# EAGLE design SmartVehicle_3 (EAGLE 7.7.0)

## Sheet 1 of 6
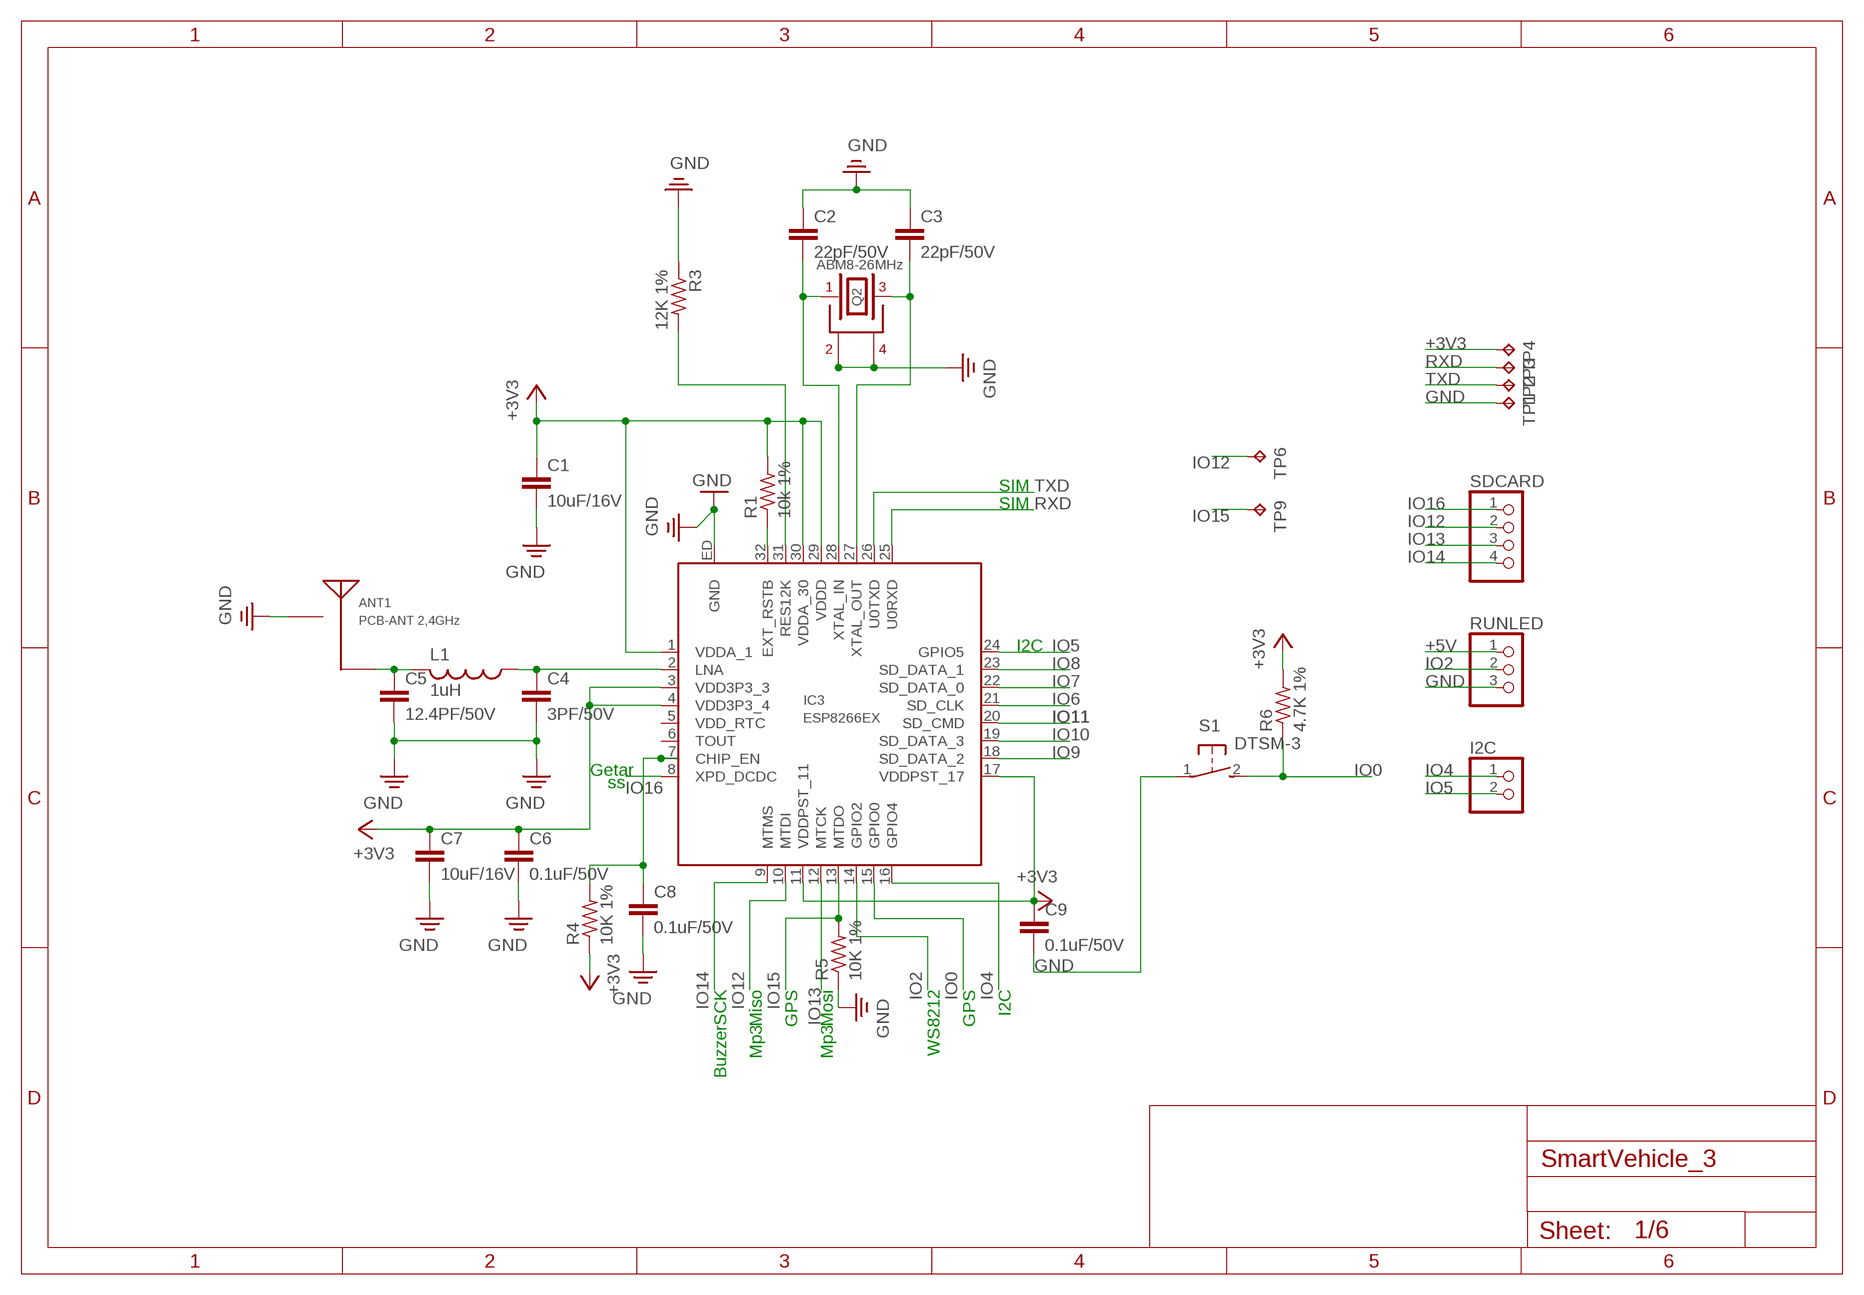
[diagram p0: schematic, sheet 1]

### Parts
ANT1  PCB-ANT 2,4GHz  2.4GHZ_PCB  [2.4GHZ_PCB]
C1  10uF/16V  C-EUC0603  [C0603]
C2  22pF/50V  C-EUC0603  [C0603]
C3  22pF/50V  C-EUC0603  [C0603]
C4  3PF/50V  C-EUC0603  [C0603]
C5  12.4PF/50V  C-EUC0603  [C0603]
C6  0.1uF/50V  C-EUC0603  [C0603]
C7  10uF/16V  C-EUC0603  [C0603]
C8  0.1uF/50V  C-EUC0603  [C0603]
C9  0.1uF/50V  C-EUC0603  [C0603]
I2C  PINHD-1X2  [1X02]
IC3  ESP8266EX  [ESP8266EX]
L1  1uH  L-USL2012C  [L2012C]
Q2  ABM8-26MHz  ABM8G  [ABM8G]
R1  10k 1%  R-US_R0603  [R0603]
R3  12K 1%  R-US_R0603  [R0603]
R4  10K 1%  R-US_R0603  [R0603]
R5  10K 1%  R-US_R0603  [R0603]
R6  4.7K 1%  R-US_R0603  [R0603]
RUNLED  PINHD-1X3  [1X03]
S1  DTSM-3  [DTSM-3]
SDCARD  PINHD-1X4  [1X04]
TP1  TPB1,27  [B1,27]
TP2  TPB1,27  [B1,27]
TP3  TPB1,27  [B1,27]
TP4  TPB1,27  [B1,27]
TP6  TPB1,27  [B1,27]
TP9  TPB1,27  [B1,27]

### Nets
+3V3: C1.1 C6.1 C7.1 C9.1 IC3.1(VDDA_1) IC3.3(VDD3P3_3) IC3.4(VDD3P3_4) IC3.11(VDDPST_11) IC3.17(VDDPST_17) IC3.29(VDDD) IC3.30(VDDA_30) R1.2 R4.1 R6.2 TP4.TP ; also sheet 3,4
+5V: RUNLED.1 ; also sheet 2,3,5,6
GND: ANT1.GND C1.2 C2.1 C3.1 C4.2 C5.2 C6.2 C7.2 C8.2 C9.2 IC3.ED(GND) Q2.2 Q2.4 R3.1 R5.1 RUNLED.3 S1.1 TP1.TP ; also sheet 2,3,4,5,6
IO0: IC3.15(GPIO0) R6.1 S1.2
IO2: IC3.14(GPIO2) RUNLED.2
IO4: I2C.1 IC3.16(GPIO4) ; also sheet 4
IO5: I2C.2 IC3.24(GPIO5) ; also sheet 4
IO6: IC3.21(SD_CLK)
IO7: IC3.22(SD_DATA_0)
IO8: IC3.23(SD_DATA_1)
IO9: IC3.18(SD_DATA_2)
IO10: IC3.19(SD_DATA_3)
IO11: IC3.20(SD_CMD)
IO12: IC3.10(MTDI) SDCARD.2 TP6.TP
IO13: IC3.12(MTCK) SDCARD.3 ; also sheet 3
IO14: IC3.9(MTMS) SDCARD.4
IO15: IC3.13(MTDO) R5.2 TP9.TP ; also sheet 3
IO16: IC3.8(XPD_DCDC) SDCARD.1
N$1: IC3.32(EXT_RSTB) R1.1
N$2: IC3.31(RES12K) R3.2
N$3: C2.2 IC3.28(XTAL_IN) Q2.1
N$4: C4.1 IC3.2(LNA) L1.1
N$5: C3.2 IC3.27(XTAL_OUT) Q2.3
N$6: ANT1.ANT C5.1 L1.2
N$10: C8.1 IC3.7(CHIP_EN) R4.2
RXD: IC3.25(U0RXD) TP3.TP ; also sheet 2
TXD: IC3.26(U0TXD) TP2.TP ; also sheet 2
Unconnected: IC3.5(VDD_RTC) IC3.6(TOUT)

### Notes on the sheet
- SIM
- SIM
- I2C
- Getar | ss
- SCK | Miso | GPS | Mosi | WS8212 | GPS | I2C
- Buzzer | Mp3 | Mp3

## Sheet 2 of 6
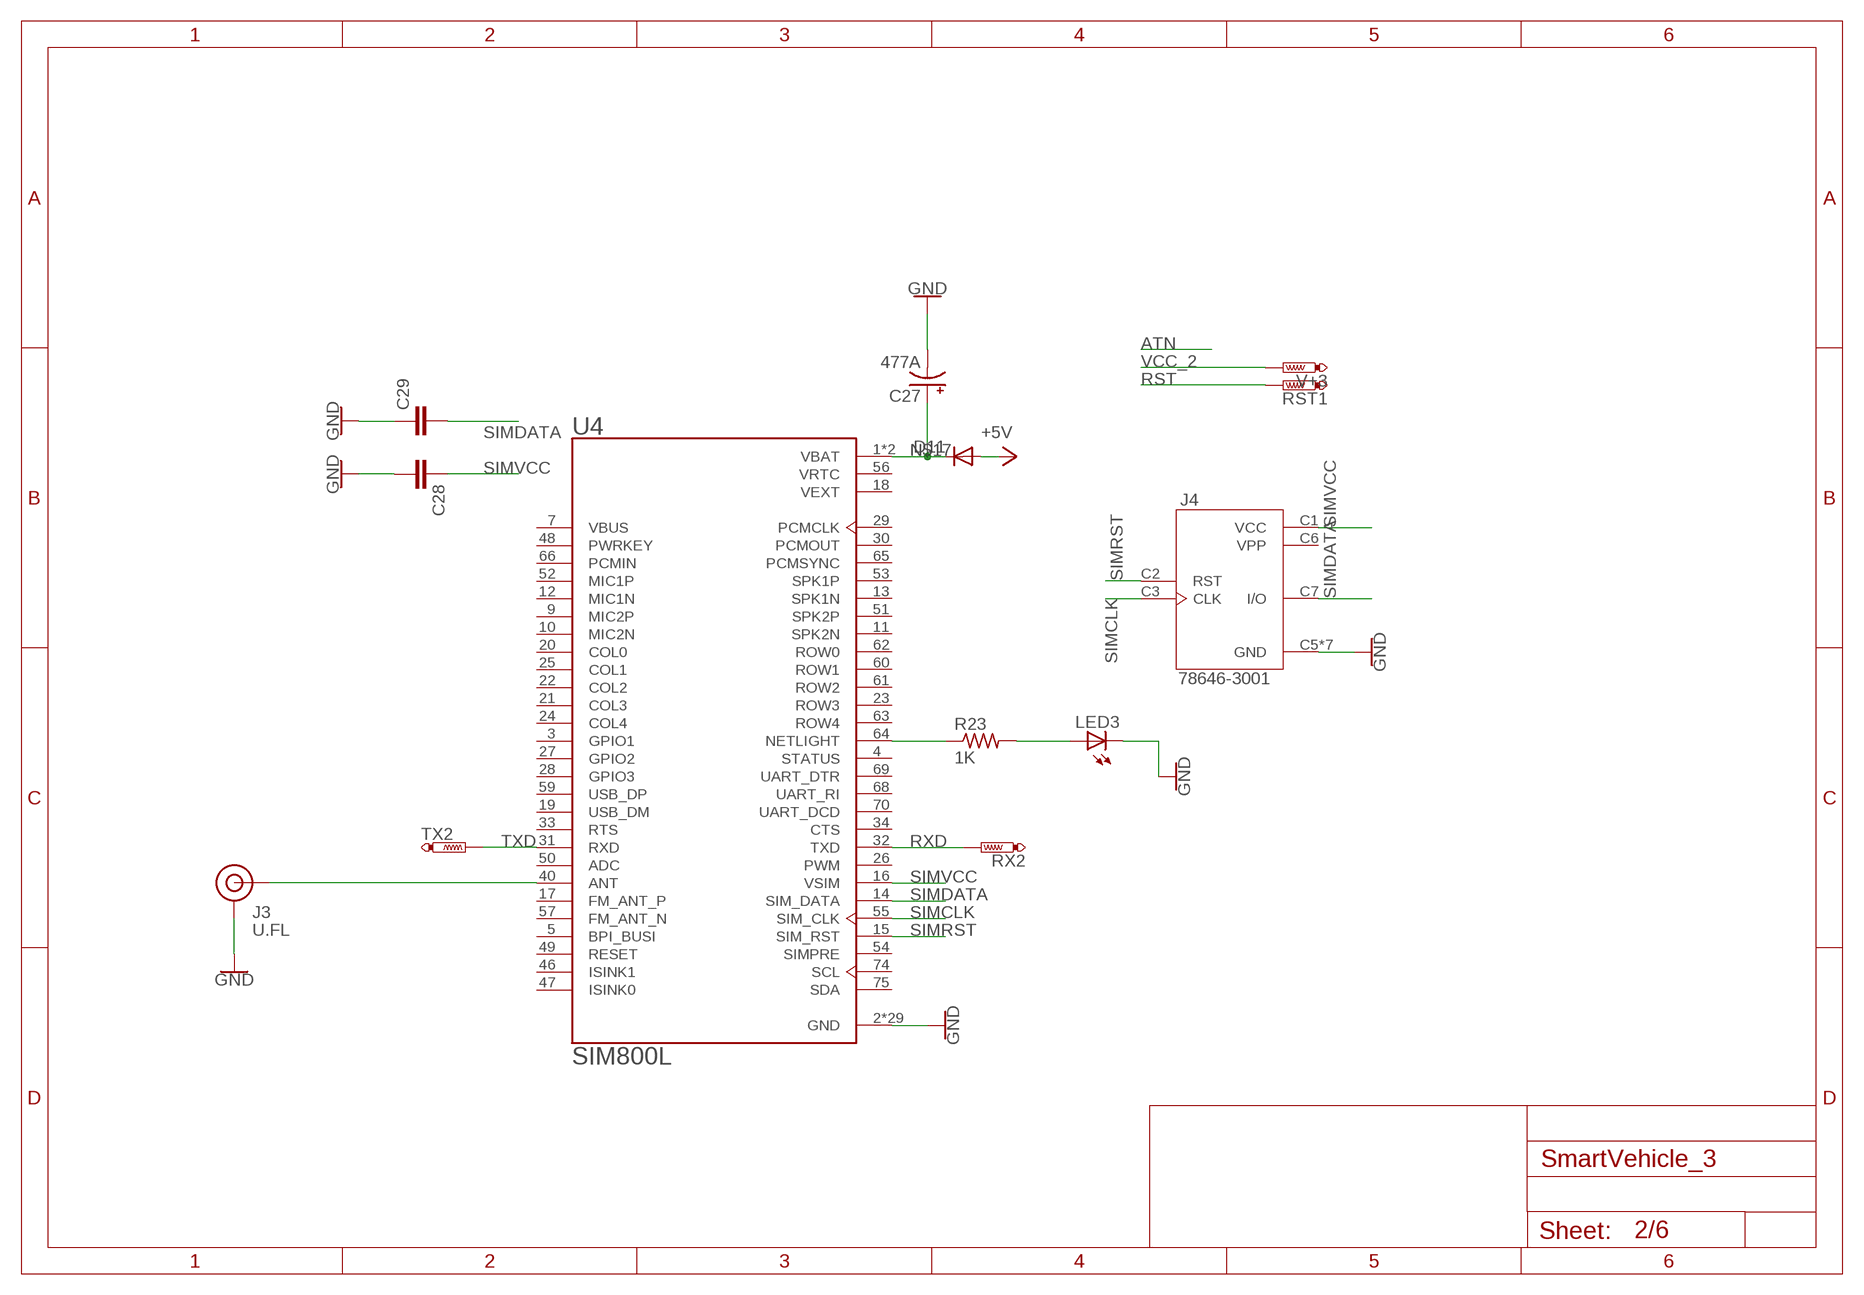
[diagram p1: schematic, sheet 2]

### Parts
C27  477A  CPOL-USCT7343  [CT7343]
C28  C-EUC0805  [C0805]
C29  C-EUC0805  [C0805]
D11  DIODE-DO214AC  [DO214AC]
J3  U.FL  U.FL2PIN  [U.FL]
J4  78646-3001  [MOLEX_78646-3001]
LED3  LEDCHIP-LED0805  [CHIP-LED0805]
R23  1K  R-US_R0603  [R0603]
RST1  PTR1TP08R  [TP08R]
RX2  PTR1TP08R  [TP08R]
TX2  PTR1TP08R  [TP08R]
U4  SIM800L  [MODULE_SIM800L]
V+3  PTR1TP08R  [TP08R]

### Nets
+5V: D11.A ; also sheet 1,3,5,6
GND: C27.- C28.2 C29.1 J3.1(GND) J3.2(GND) J4.C5(GND) J4.G1(GND) J4.G2(GND) J4.G3(GND) J4.G4(GND) J4.G5(GND) J4.G6(GND) LED3.C U4.2(GND) U4.6(GND) U4.8(GND) U4.35(GND) U4.37(GND) U4.38(GND) U4.39(GND) U4.41(GND) U4.43(GND) U4.44(GND) U4.45(GND) U4.58(GND) U4.67(GND) U4.71(GND) U4.72(GND) U4.73(GND) U4.76(GND) U4.77(GND) U4.78(GND) U4.79(GND) U4.80(GND) U4.81(GND) U4.82(GND) U4.83(GND) U4.84(GND) U4.85(GND) U4.86(GND) U4.87(GND) U4.88(GND) ; also sheet 1,3,4,5,6
N$12: R23.1 U4.64(NETLIGHT)
N$17: C27.+ D11.C U4.1(VBAT) U4.42(VBAT)
N$46: LED3.A R23.2
N$47: J3.FEED(SIGNAL) U4.40(ANT)
RST: RST1.TP
RXD: RX2.TP U4.32(TXD) ; also sheet 1
SIMCLK: J4.C3(CLK) U4.55(SIM_CLK)
SIMDATA: C29.2 J4.C7(I/O) U4.14(SIM_DATA)
SIMRST: J4.C2(RST) U4.15(SIM_RST)
SIMVCC: C28.1 J4.C1(VCC) U4.16(VSIM)
TXD: TX2.TP U4.31(RXD) ; also sheet 1
VCC_2: V+3.TP
Unconnected: U4.3(GPIO1) U4.4(STATUS) U4.5(BPI_BUSI) U4.7(VBUS) U4.9(MIC2P) U4.10(MIC2N) U4.11(SPK2N) U4.12(MIC1N) U4.13(SPK1N) U4.17(FM_ANT_P) U4.19(USB_DM) U4.20(COL0) U4.21(COL3) U4.22(COL2) U4.23(ROW3) U4.24(COL4) U4.25(COL1) U4.26(PWM) U4.27(GPIO2) U4.28(GPIO3) U4.29(PCMCLK) U4.30(PCMOUT) U4.33(RTS) U4.34(CTS) U4.46(ISINK1) U4.47(ISINK0) U4.48(PWRKEY) U4.49(RESET) U4.50(ADC) U4.51(SPK2P) U4.52(MIC1P) U4.53(SPK1P) U4.54(SIMPRE) U4.57(FM_ANT_N) U4.59(USB_DP) U4.60(ROW1) U4.61(ROW2) U4.62(ROW0) U4.63(ROW4) U4.65(PCMSYNC) U4.66(PCMIN) U4.68(UART_RI) U4.69(UART_DTR) U4.70(UART_DCD) U4.74(SCL) U4.75(SDA)

## Sheet 3 of 6
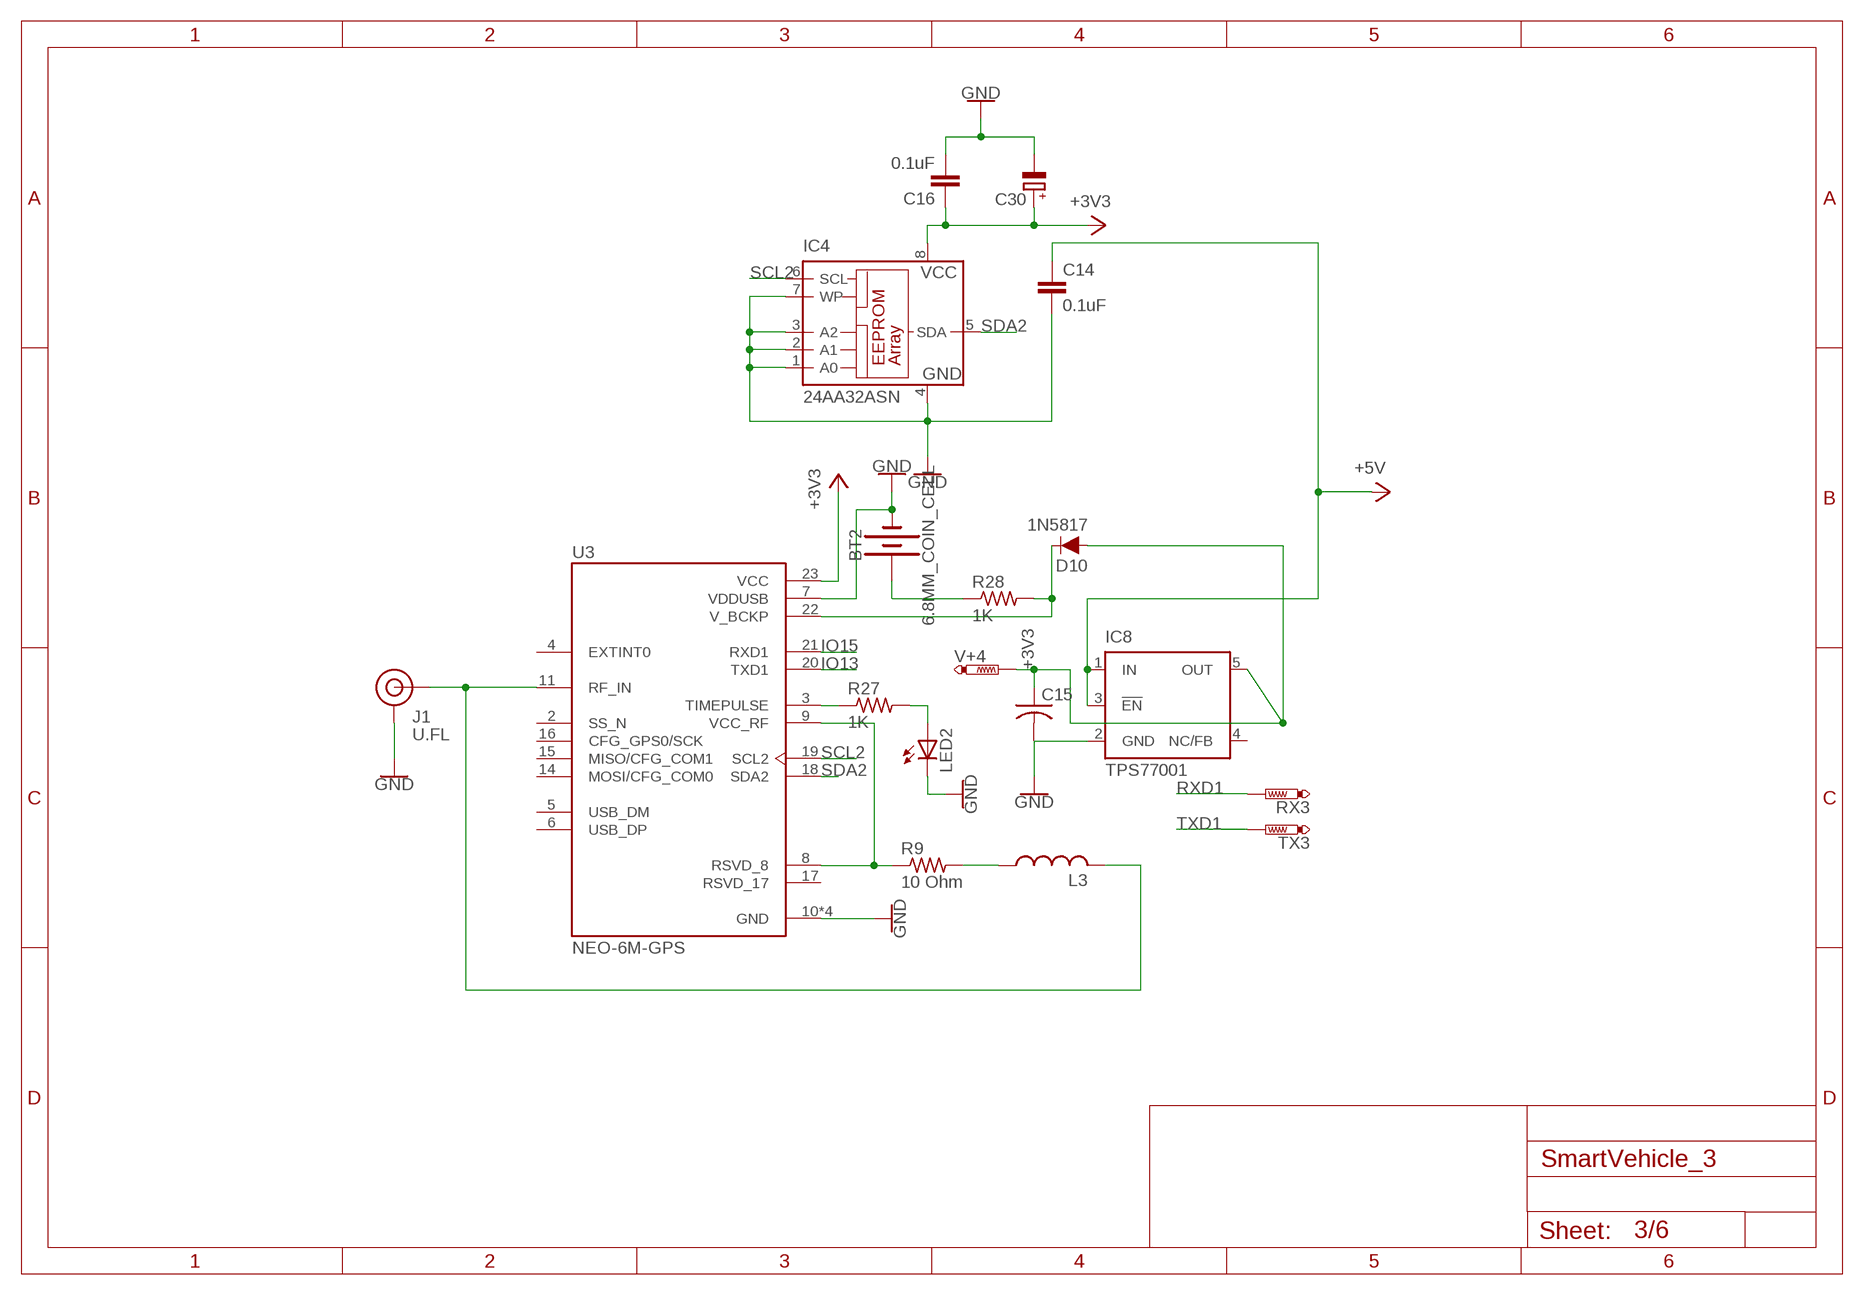
[diagram p2: schematic, sheet 3]

### Parts
BT2  6.8MM_COIN_CELL  BATTERY-6.8MM_SMD  [BATTCON-6.8MM]
C14  0.1uF  0.1UF-0603-25V-(+80/-20%)  [0603]
C15  C-USC0603K  [C0603K]
C16  0.1uF  0.1UF-0603-25V-(+80/-20%)  [0603]
C30  CPOL-EUCT3528  [CT3528]
D10  1N5817  DIODE-BAS16J  [SOD-323]
IC4  24AA32ASN  [SO-08]
IC8  TPS77001  [SOT23-DBV]
J1  U.FL  U.FL2PIN  [U.FL]
L3  L-USL2012C  [L2012C]
LED2  LEDCHIP-LED0805  [CHIP-LED0805]
R9  10 Ohm  R-US_R0603  [R0603]
R27  1K  R-US_R0603  [R0603]
R28  1K  R-US_R0603  [R0603]
RX3  PTR1TP08R  [TP08R]
TX3  PTR1TP08R  [TP08R]
U3  NEO-6M-GPS  [XCVR_NEO-6M-GPS]
V+4  PTR1TP08R  [TP08R]

### Nets
+3V3: C15.1 C16.1 C30.+ D10.A IC4.8(VCC) IC8.5(OUT) U3.23(VCC) V+4.TP ; also sheet 1,4
+5V: C14.1 IC8.1(IN) IC8.3(!EN) ; also sheet 1,2,5,6
GND: BT2.- C14.2 C15.2 C16.2 C30.- IC4.1(A0) IC4.2(A1) IC4.3(A2) IC4.4(GND) IC4.7(WP) IC8.2(GND) J1.1(GND) J1.2(GND) LED2.C U3.7(VDDUSB) U3.10(GND) U3.12(GND) U3.13(GND) U3.24(GND) ; also sheet 1,2,4,5,6
IO13: U3.20(TXD1) ; also sheet 1
IO15: U3.21(RXD1) ; also sheet 1
N$20: R27.1 U3.3(TIMEPULSE)
N$21: LED2.A R27.2
N$29: D10.C R28.2 U3.22(V_BCKP)
N$48: R9.1 U3.8(RSVD_8) U3.9(VCC_RF)
N$50: L3.1 R9.2
N$52: BT2.+ R28.1
N$58: J1.FEED(SIGNAL) L3.2 U3.11(RF_IN)
RXD1: RX3.TP
SCL2: IC4.6(SCL) U3.19(SCL2)
SDA2: IC4.5(SDA) U3.18(SDA2)
TXD1: TX3.TP
Unconnected: IC8.4(NC/FB) U3.2(SS_N) U3.4(EXTINT0) U3.5(USB_DM) U3.6(USB_DP) U3.14(MOSI/CFG_COM0) U3.15(MISO/CFG_COM1) U3.16(CFG_GPS0/SCK) U3.17(RSVD_17)

## Sheet 4 of 6
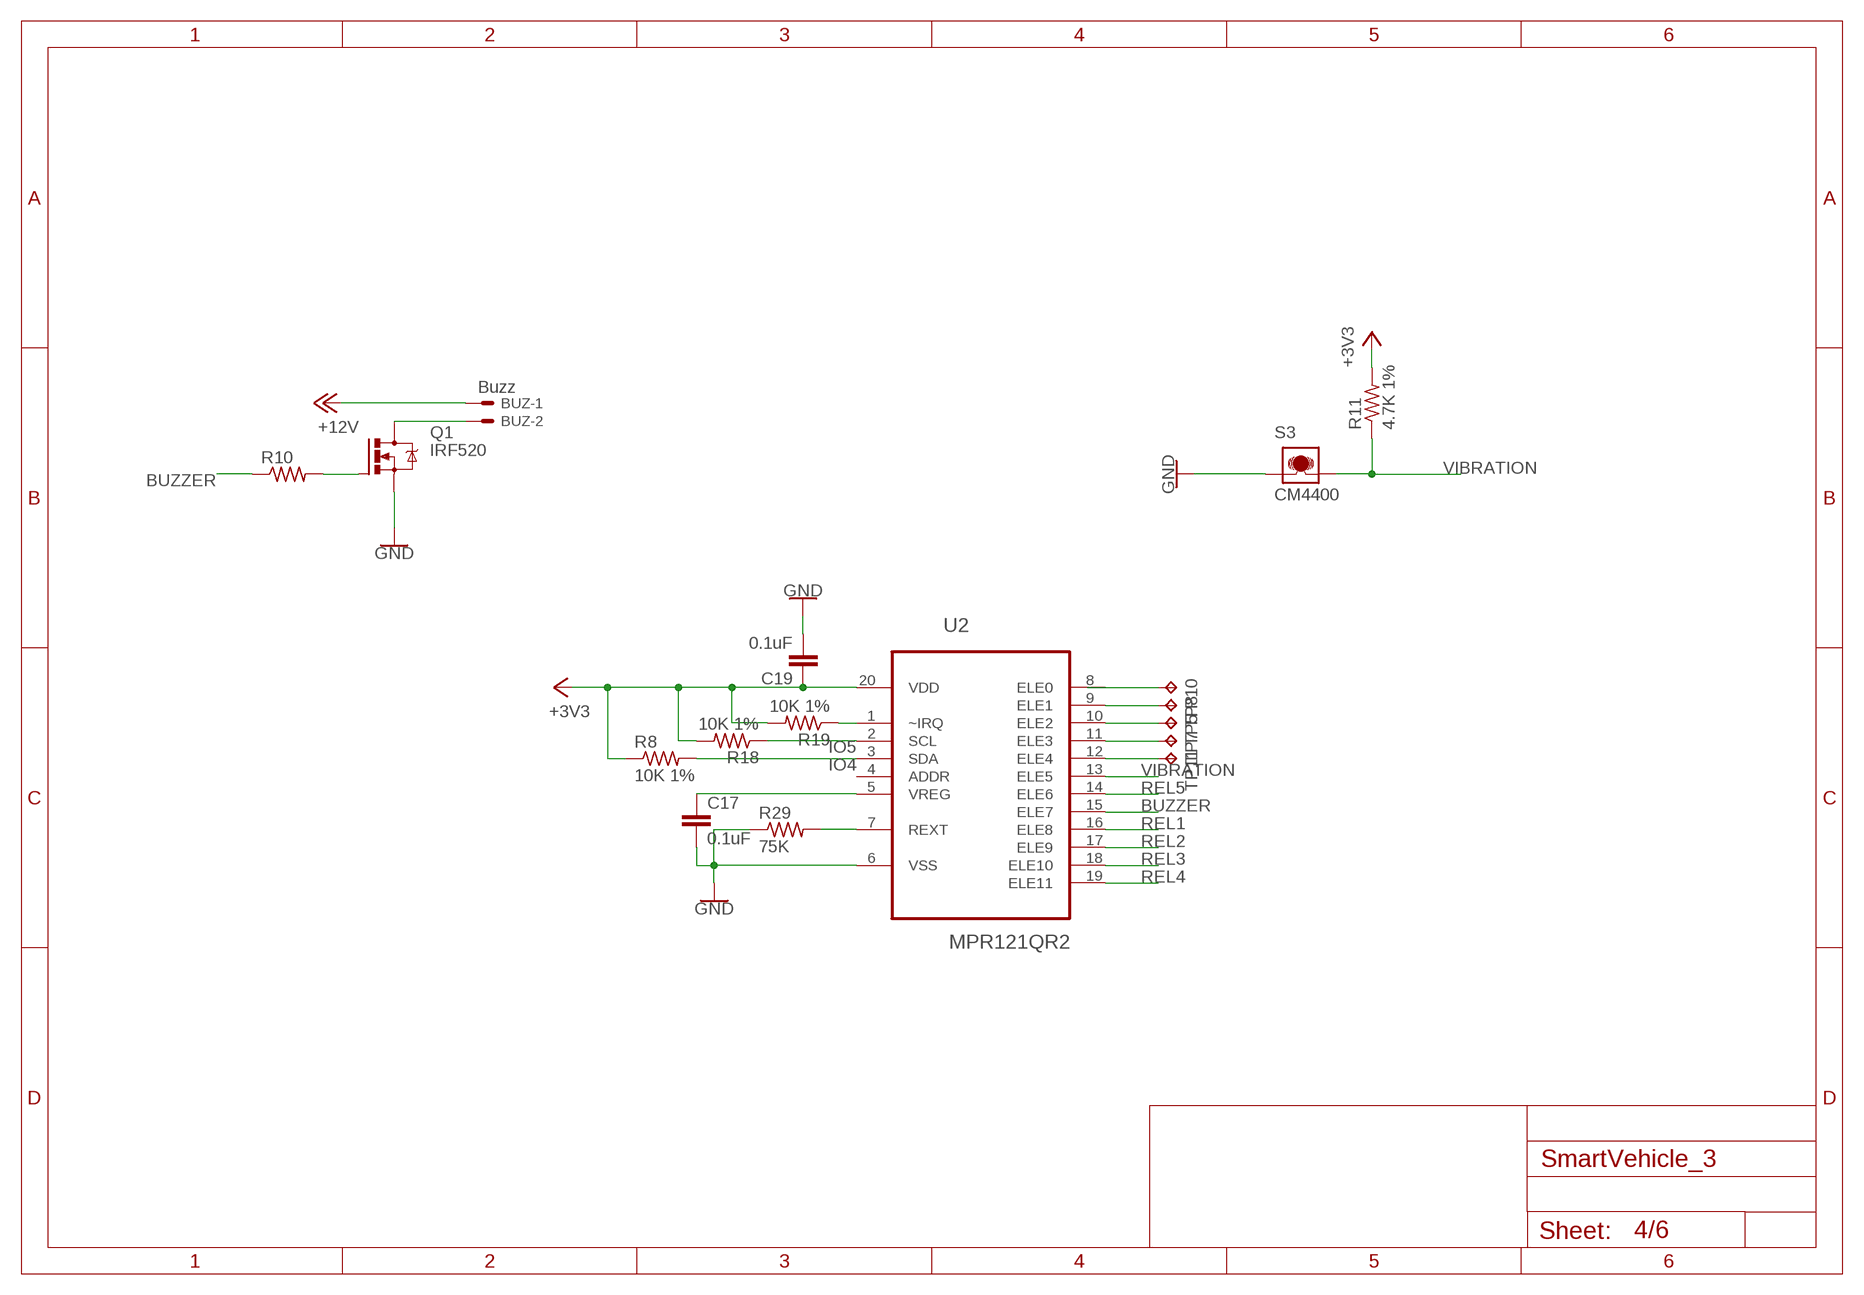
[diagram p3: schematic, sheet 4]

### Parts
BUZ  Buzz  22-23-2021  [22-23-2021]
C17  0.1uF  C-EUC0603  [C0603]
C19  0.1uF  C-EUC0603  [C0603]
Q1  IRF520  [TO220BV]
R8  10K 1%  R-US_R0603  [R0603]
R10  R-US_R0603  [R0603]
R11  4.7K 1%  R-US_R0603  [R0603]
R18  10K 1%  R-US_R0603  [R0603]
R19  10K 1%  R-US_R0603  [R0603]
R29  75K  R-US_R0603  [R0603]
S3  CM4400  [CM4400]
TP5  TPB1,27  [B1,27]
TP7  TPB1,27  [B1,27]
TP8  TPB1,27  [B1,27]
TP10  TPB1,27  [B1,27]
TP11  TPB1,27  [B1,27]
U2  MPR121QR2  [QFN40P300X300X60-20N]

### Nets
+3V3: C19.1 R8.1 R11.2 R18.2 R19.2 U2.20(VDD) ; also sheet 1,3
+12V: BUZ.1 ; also sheet 5,6
BUZZER: R10.1 U2.15(ELE7)
GND: C17.2 C19.2 Q1.S R29.1 S3.1 U2.6(VSS) ; also sheet 1,2,3,5,6
IO4: R8.2 U2.3(SDA) ; also sheet 1
IO5: R18.1 U2.2(SCL) ; also sheet 1
N$9: TP10.TP U2.8(ELE0)
N$13: R19.1 U2.1(~IRQ)
N$14: R29.2 U2.7(REXT)
N$15: TP8.TP U2.9(ELE1)
N$16: Q1.G R10.2
N$18: C17.1 U2.5(VREG)
N$22: TP11.TP U2.12(ELE4)
N$26: BUZ.2 Q1.D
N$30: TP5.TP U2.10(ELE2)
N$31: TP7.TP U2.11(ELE3)
REL1: U2.16(ELE8) ; also sheet 5
REL2: U2.17(ELE9) ; also sheet 5
REL3: U2.18(ELE10) ; also sheet 5
REL4: U2.19(ELE11) ; also sheet 5
REL5: U2.14(ELE6) ; also sheet 5
VIBRATION: R11.1 S3.2 U2.13(ELE5)
Unconnected: U2.4(ADDR)

## Sheet 5 of 6
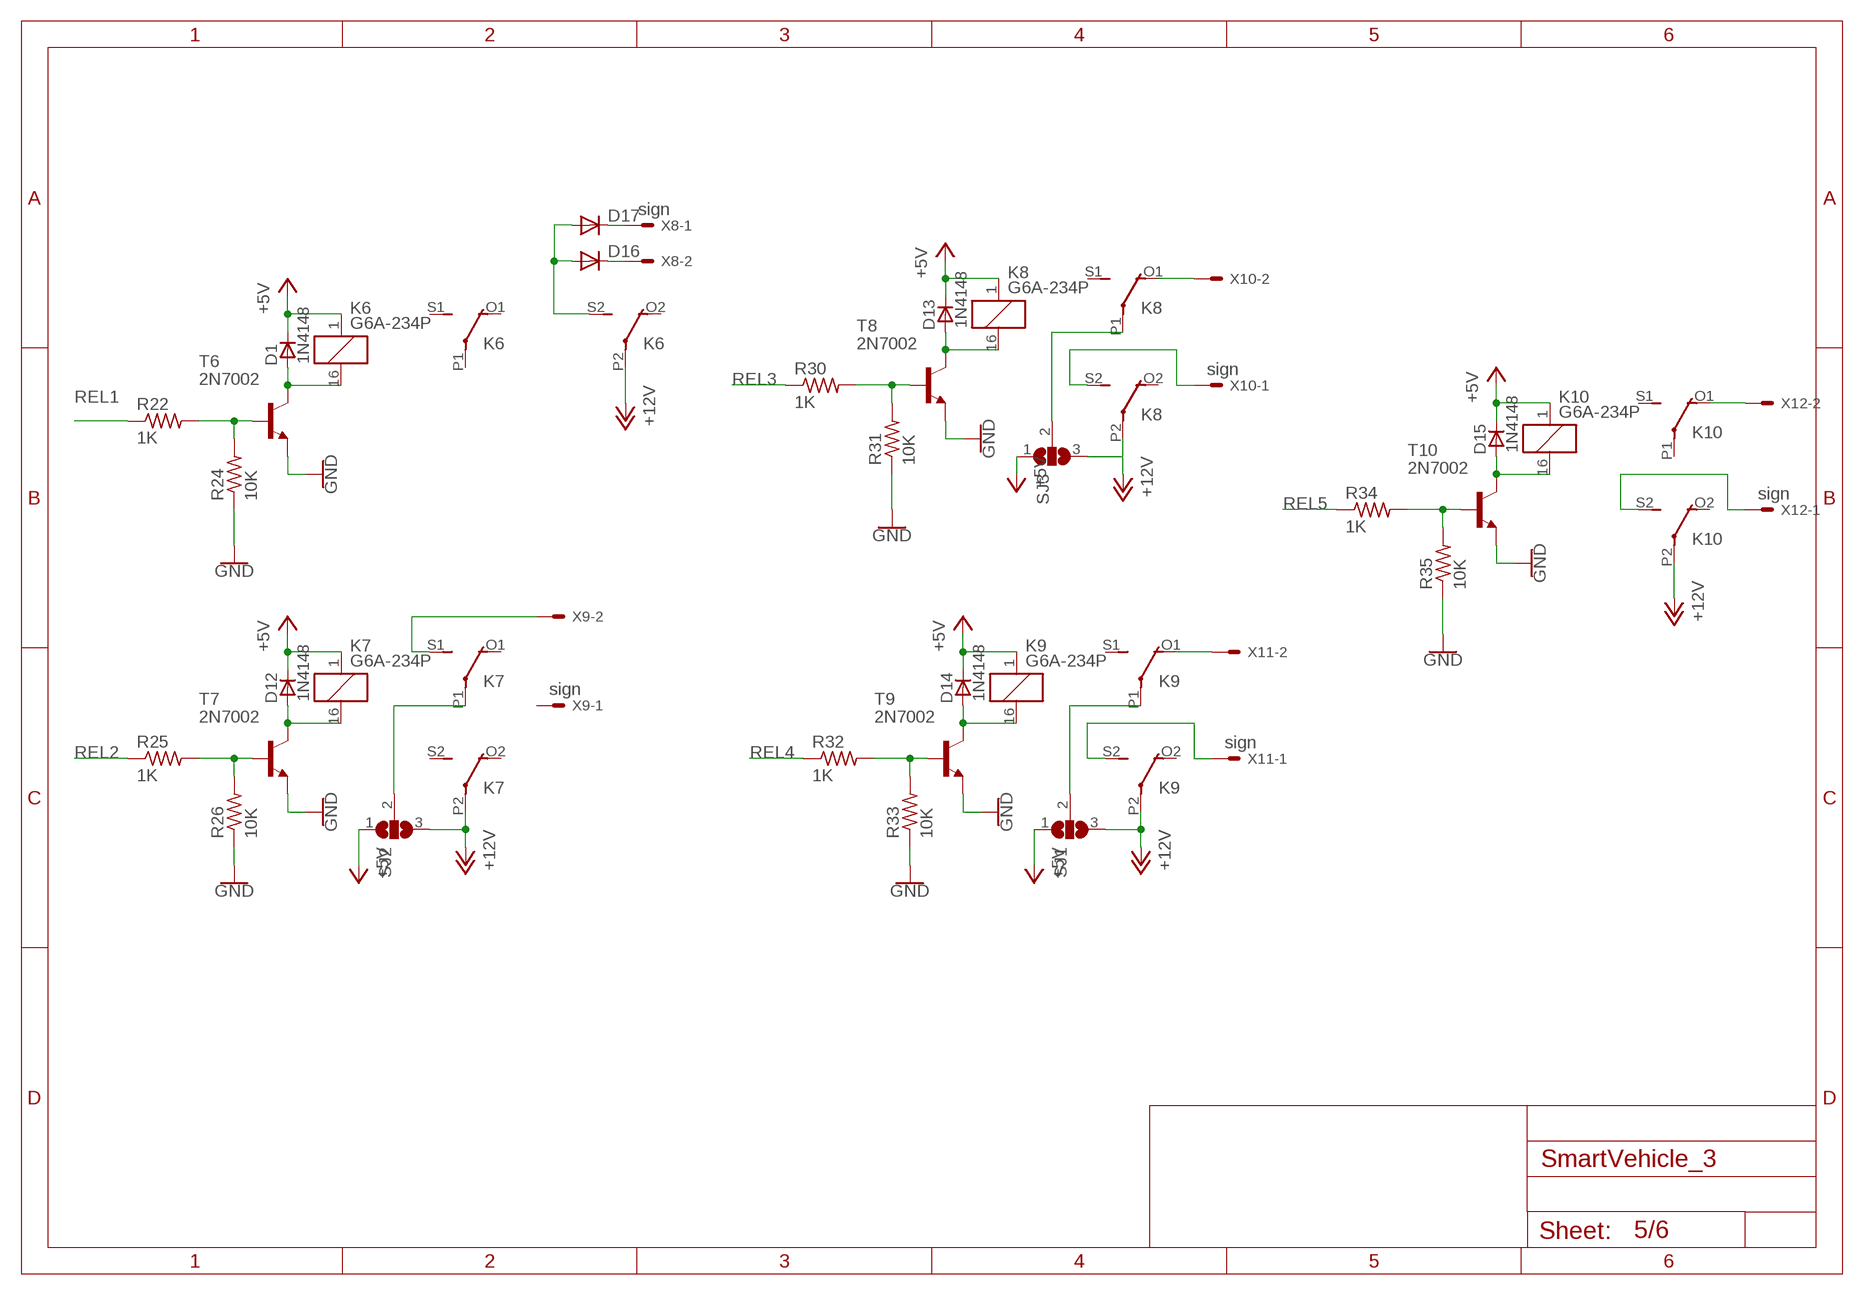
[diagram p4: schematic, sheet 5]

### Parts
D1  1N4148  LL4148  [SOD80_DO213AA_MINIMELF]
D12  1N4148  LL4148  [SOD80_DO213AA_MINIMELF]
D13  1N4148  LL4148  [SOD80_DO213AA_MINIMELF]
D14  1N4148  LL4148  [SOD80_DO213AA_MINIMELF]
D15  1N4148  LL4148  [SOD80_DO213AA_MINIMELF]
D16  DIODE-DO214AA  [DO214AA]
D17  DIODE-DO214AA  [DO214AA]
K6  G6A-234P  [G6A-234P]
K7  G6A-234P  [G6A-234P]
K8  G6A-234P  [G6A-234P]
K9  G6A-234P  [G6A-234P]
K10  G6A-234P  [G6A-234P]
R22  1K  R-US_M0805  [M0805]
R24  10K  R-US_M0805  [M0805]
R25  1K  R-US_M0805  [M0805]
R26  10K  R-US_M0805  [M0805]
R30  1K  R-US_M0805  [M0805]
R31  10K  R-US_M0805  [M0805]
R32  1K  R-US_M0805  [M0805]
R33  10K  R-US_M0805  [M0805]
R34  1K  R-US_M0805  [M0805]
R35  10K  R-US_M0805  [M0805]
SJ1  SJ2W  [SJ_2]
SJ2  SJ2W  [SJ_2]
SJ3  SJ2W  [SJ_2]
T6  2N7002  MMBT2222ALT1-NPN-SOT23-BEC  [SOT23-BEC]
T7  2N7002  MMBT2222ALT1-NPN-SOT23-BEC  [SOT23-BEC]
T8  2N7002  MMBT2222ALT1-NPN-SOT23-BEC  [SOT23-BEC]
T9  2N7002  MMBT2222ALT1-NPN-SOT23-BEC  [SOT23-BEC]
T10  2N7002  MMBT2222ALT1-NPN-SOT23-BEC  [SOT23-BEC]
X8  sign  22-23-2021  [22-23-2021]
X9  sign  22-23-2021  [22-23-2021]
X10  sign  22-23-2021  [22-23-2021]
X11  sign  22-23-2021  [22-23-2021]
X12  sign  22-23-2021  [22-23-2021]

### Nets
+5V: D1.C D12.C D13.C D14.C D15.C K6.1 K7.1 K8.1 K9.1 K10.1 SJ1.1 SJ2.1 SJ3.1 ; also sheet 1,2,3,6
+12V: K6.P2(3:P) K7.P2(3:P) K8.P2(3:P) K9.P2(3:P) K10.P2(3:P) SJ1.3 SJ2.3 SJ3.3 ; also sheet 4,6
GND: R24.1 R26.1 R31.1 R33.1 R35.1 T6.E T7.E T8.E T9.E T10.E ; also sheet 1,2,3,4,6
N$11: D16.A D17.A K6.S2(3:S)
N$19: K9.P1(2:P) SJ1.2
N$23: D17.C X8.1
N$27: K8.P1(2:P) SJ3.2
N$28: K7.P1(2:P) SJ2.2
N$32: K7.S1(2:S) X9.2
N$49: D16.C X8.2
N$51: D1.A K6.16 T6.C
N$53: R22.2 R24.2 T6.B
N$54: D12.A K7.16 T7.C
N$55: R25.2 R26.2 T7.B
N$60: D13.A K8.16 T8.C
N$61: R30.2 R31.2 T8.B
N$62: K8.O1(2:O) X10.2
N$63: K8.S2(3:S) X10.1
N$64: D14.A K9.16 T9.C
N$65: R32.2 R33.2 T9.B
N$66: K9.O1(2:O) X11.2
N$67: K9.S2(3:S) X11.1
N$68: D15.A K10.16 T10.C
N$69: R34.2 R35.2 T10.B
N$70: K10.O1(2:O) X12.2
N$71: K10.S2(3:S) X12.1
REL1: R22.1 ; also sheet 4
REL2: R25.1 ; also sheet 4
REL3: R30.1 ; also sheet 4
REL4: R32.1 ; also sheet 4
REL5: R34.1 ; also sheet 4
Unconnected: K6.O1(2:O) K6.O2(3:O) K6.P1(2:P) K6.S1(2:S) K7.O1(2:O) K7.O2(3:O) K7.S2(3:S) K8.O2(3:O) K8.S1(2:S) K9.O2(3:O) K9.S1(2:S) K10.O2(3:O) K10.P1(2:P) K10.S1(2:S) X9.1

## Sheet 6 of 6
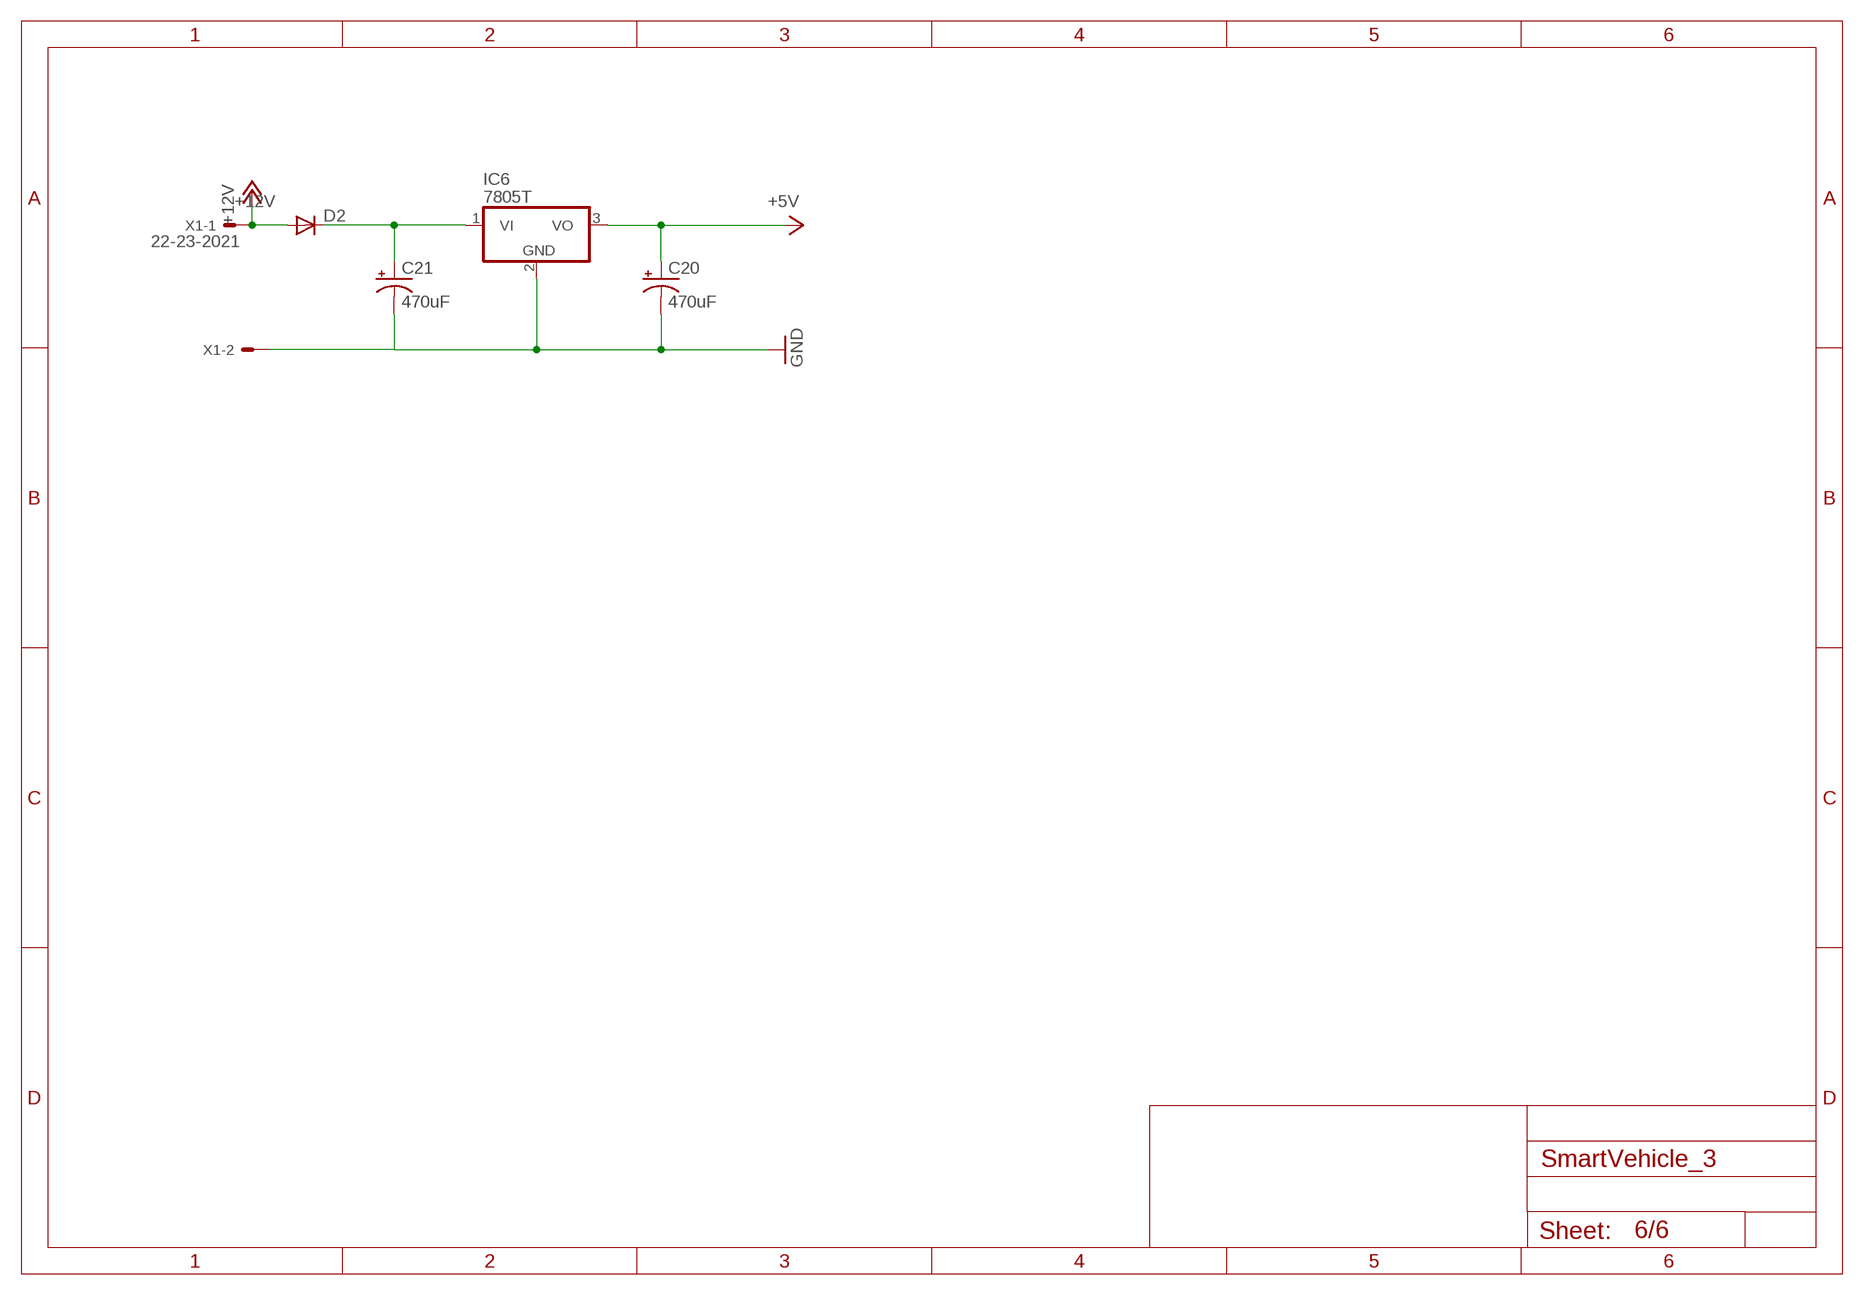
[diagram p5: schematic, sheet 6]

### Parts
C20  470uF  CPOL-USE3.5-8  [E3,5-8]
C21  470uF  CPOL-USE3.5-8  [E3,5-8]
D2  DIODE-DO214AC  [DO214AC]
IC6  7805T  [TO220H]
X1  22-23-2021  [22-23-2021]

### Nets
+5V: C20.+ IC6.3(VO) ; also sheet 1,2,3,5
+12V: D2.A X1.1 ; also sheet 4,5
GND: C20.- C21.- IC6.2(GND) X1.2 ; also sheet 1,2,3,4,5
N$24: C21.+ D2.C IC6.1(VI)

## Power pins joined to a net without a drawn wire
VEXT: U4.18(VEXT)
VPP: J4.C6(VPP)
VRTC: U4.56(VRTC)

## Library data of the parts
ANT1 = Liers_RF:2.4GHZ_PCB
BT2 = SparkFun-Batteries:BATTERY: Battery - Single Cell A variety of battery chemistries, sizes, and footprints. Device List: 20MM_PTH - Coin Cell Battery Holder - 20mm (PTH) <https://www.sparkfun.com/products/783> 6.8MM_PTH - Coin Cell Battery Holder - 6.8MM(SMD) <https://www.digikey.com/product-detail/en/seiko-instruments/MS621FE-FL11E/728-1057-ND/1889208?WT.srch=1&gclid=CNOQ5a6LzdQCFZS2wAodXCkE0g> 12MM_SMD - Coin Cell Battery Holder - 12mm (SMD) <https://www.sparkfun.com/products/10592> 12MM_PTH - Coin Cell Battery Holder - 12mm (PTH) <https://www.sparkfun.com/products/7948> 20MM_SMD - 20mm Coin Cell Battery Holder (SMD) (2 legs) Used on the Big Time Watch Kit <https://www.sparkfun.com/products/11734> 20MM_SMD_4LEGS - Coin Cell Battery Holder - 20mm (SMD) <https://www.sparkfun.com/products/11892> 20MM_SMD_4LEGS_OVERPASTE - Coin Cell Battery Holder - 20mm (SMD) <https://www.sparkfun.com/products/11892> (Over-paste on the legs) 24.5MM_PTH - Coin Cell Battery Holder - 24.5mm (PTH) <https://www.sparkfun.com/products/8863> 9V - 9V Battery Holder - PC Mount Used on the SparkFun SparkPunk Sound Kit <https://www.sparkfun.com/products/11177> and SparkFun SparkPunk Sequencer Kit <https://www.sparkfun.com/products/12707> 18650 - Battery Holder - 18650 (PTH) <https://www.sparkfun.com/products/13113> AA - Battery Holder - 1xAA (PTH) <https://www.sparkfun.com/products/7949> AAA - Battery Holder - 1xAAA (PTH) <https://www.sparkfun.com/products/12718> AA_KIT - Battery Holder - 1xAA (PTH) <https://www.sparkfun.com/products/7949> Special kit package - pads only have exposed copper on one side of the board. AAA_KIT - Battery Holder - 1xAAA (PTH) <https://www.sparkfun.com/products/12718> Special kit package - pads only have exposed copper on one side of the board.; PROD_ID: BATT-13734
BUZ X1 X8-X12 = con-molex:22-23-2021: .100" (2.54mm) Center Header - 2 Pin; MF: MOLEX; MPN: 22-23-2021; OC_FARNELL: 1462926; OC_NEWARK: 25C3832
C1-C9 C17 C19 C28 C29 = rcl:C-EU: CAPACITOR, European symbol
C14 C16 = SparkFun-Capacitors:0.1UF: 0.1µF ceramic capacitors A capacitor is a passive two-terminal electrical component used to store electrical energy temporarily in an electric field.; PROD_ID: CAP-00810
C15 = rcl:C-US: CAPACITOR, American symbol
C20 C21 C27 = rcl:CPOL-US: POLARIZED CAPACITOR, American symbol
C30 = rcl:CPOL-EU: POLARIZED CAPACITOR, European symbol
D1 D12-D15 = diodes_smd:LL4148: 1N4148 General Purpose Rectifie SMD-Version of 1N4148 Case: SOD 80 = DO 213 AA = MINIMELF (Glass) Author: Dipl.-Ing. FH Rainer Bayer HHN Hochschule Heilbronn, rainer.bayer@hs-heilbronn.de Ingenieurbüro ing-rb, mail@ing-rb.de
D2 D11 D16 D17 = diode:DIODE-: DIODE
D10 = SparkFun-DiscreteSemi:DIODE: Diode These are standard reverse protection diodes and small signal diodes. SparkFun Products: SparkFun SparkPunk Sound Kit <https://www.sparkfun.com/products/11177> SparkFun ESP8266 Thing <https://www.sparkfun.com/products/13231>; PROD_ID: DIO-09646; VALUE: 250mA/100V
I2C = pinhead:PINHD-1X2: PIN HEADER
IC3 = LIOT:ESP8266EX
IC4 = microchip:24*: Serial EEPROM I2C; MF: MICROCHIP; MPN: 24AA32A-I/SN; OC_FARNELL: 1617659; OC_NEWARK: 83C5815
IC6 = linear:78*: Positive VOLTAGE REGULATOR Source: http://cache.national.com/ds/LM/LM78L05.pdf http://www.fairchildsemi.com/ds/LM/LM7805.pdf
IC8 = texas:TPS770*: ULTRALOW-POWER 50-mA LOW-DROPOUT LINEAR REGULATORS 50-mA Low-Dropout Regulator Source: http://focus.ti.com/lit/ds/symlink/tps77001.pdf; MF: TEXAS INSTRUMENTS; MPN: TPS77001DBVT; OC_FARNELL: 8461554; OC_NEWARK: 77C1171
J1 J3 = SparkFun-Connectors:U.FL2PIN: SMD Antenna Connector - U.FL 2mm height, 3.0mm x 3.0mm receptacle size. SparkFun Products: SparkFun WiFi Shield - ESP8266 <https://www.sparkfun.com/products/13287> SparkFun ESP8266 Thing <https://www.sparkfun.com/products/13231> SparkFun MiniGen - Pro Mini Signal Generator Shield <https://www.sparkfun.com/products/11420>; PROD_ID: CONN-09193; SF_ID: WRL-09144
J4 = 78646-3001:78646-3001: Conn Micro SIM Card SKT 6 POS 2.54mm Solder RA SMD 0.5A/Contact Embossed T/R; AVAILABILITY: Unavailable; DESCRIPTION: Conn Micro SIM Card SKT 6 POS 2.54mm Solder RA SMD 0.5A/Contact Embossed T/R; MF: Molex; MP: 78646-3001; PACKAGE: None; PRICE: None
K6-K10 = relay:G6A-234P: RELAY 2 x switch, 0.3 A/125 V AC, 1 A/30 V DC, Omron; OC_FARNELL: unknown; OC_NEWARK: unknown
L1 = resistor:L-US: INDUCTOR, American symbol
L3 = rcl:L-US: INDUCTOR, American symbol
LED2 LED3 = led:LED: LED OSRAM: - CHIPLED LG R971, LG N971, LY N971, LG Q971, LY Q971, LO R971, LY R971 LH N974, LH R974 LS Q976, LO Q976, LY Q976 LO Q996 - Hyper CHIPLED LW Q18S LB Q993, LB Q99A, LB R99A - SideLED LS A670, LO A670, LY A670, LG A670, LP A670 LB A673, LV A673, LT A673, LW A673 LH A674 LY A675 LS A676, LA A676, LO A676, LY A676, LW A676 LS A679, LY A679, LG A679 - Hyper Micro SIDELED® LS Y876, LA Y876, LO Y876, LY Y876 LT Y87S - SmartLED LW L88C, LW L88S LB L89C, LB L89S, LG L890 LS L89K, LO L89K, LY L89K LS L896, LA L896, LO L896, LY L896 - TOPLED LS T670, LO T670, LY T670, LG T670, LP T670 LSG T670, LSP T670, LSY T670, LOP T670, LYG T670 LG T671, LOG T671, LSG T671 LB T673, LV T673, LT T673, LW T673 LH T674 LS T676, LA T676, LO T676, LY T676, LB T676, LH T676, LSB T676, LW T676 LB T67C, LV T67C, LT T67C, LS T67K, LO T67K, LY T67K, LW E67C LS E67B, LA E67B, LO E67B, LY E67B, LB E67C, LV E67C, LT E67C LW T67C LS T679, LY T679, LG T679 LS T770, LO T770, LY T770, LG T770, LP T770 LB T773, LV T773, LT T773, LW T773 LH T774 LS E675, LA E675, LY E675, LS T675 LS T776, LA T776, LO T776, LY T776, LB T776 LHGB T686 LT T68C, LB T68C - Hyper Mini TOPLED® LB M676 - Mini TOPLED Santana® LG M470 LS M47K, LO M47K, LY M47K Source: http://www.osram.convergy.de LUXEON: - LUMILED® LXK2-PW12-R00, LXK2-PW12-S00, LXK2-PW14-U00, LXK2-PW14-V00 LXK2-PM12-R00, LXK2-PM12-S00, LXK2-PM14-U00 LXK2-PE12-Q00, LXK2-PE12-R00, LXK2-PE12-S00, LXK2-PE14-T00, LXK2-PE14-U00 LXK2-PB12-K00, LXK2-PB12-L00, LXK2-PB12-M00, LXK2-PB14-N00, LXK2-PB14-P00, LXK2-PB14-Q00 LXK2-PR12-L00, LXK2-PR12-M00, LXK2-PR14-Q00, LXK2-PR14-R00 LXK2-PD12-Q00, LXK2-PD12-R00, LXK2-PD12-S00 LXK2-PH12-R00, LXK2-PH12-S00 LXK2-PL12-P00, LXK2-PL12-Q00, LXK2-PL12-R00 Source: www.luxeon.com KINGBRIGHT: KA-3528ASYC Source: www.kingbright.com
Q1 = transistor-power:IRF520: HEXFET Power MOSFET
Q2 = RADIO:ABM8G
R1 R3-R6 R8 R11 R18 R19 R22 R24-R26 R29-R35 = resistor:R-US_: RESISTOR, American symbol
R9 R10 R23 R27 R28 = rcl:R-US_: RESISTOR, American symbol
RST1 RX2 RX3 TX2 TX3 V+3 V+4 = testpad:PTR1: TEST PIN
RUNLED = pinhead:PINHD-1X3: PIN HEADER
S1 = switch-tact:DTSM-3
S3 = sensor-comus-group:CM4400: MOVEMENT / VIBRATION SWITCH - Mercury Contacts Source: Assemtech Europe Limited, E. Bachem GmbH Comus International, W. Gunther GmbH, Gunther Belgium; MF: FARNELL; MPN: CM4400-1.; OC_FARNELL: 540626; OC_NEWARK: 09WX7014
SDCARD = pinhead:PINHD-1X4: PIN HEADER
SJ1-SJ3 = jumper:SJ2W: SMD solder JUMPER
T6-T10 = transistor:*-NPN-: NPN Transistror BF959 corrected 2008.03.06
TP1-TP11 = testpad:TP: Test pad
U2 = MPR121QR2:MPR121QR2: Proximity Capacitive Touch Sensor Controller; AVAILABILITY: Unavailable; DESCRIPTION: Capacitive Touch Screen 12Keys 20-Pin QFN Tape and Reel; MF: NXP USA; MP: MPR121QR2; PACKAGE: QFN-20 Resurgent; PRICE: None
U3 = NEO-6M-GPS:NEO-6M-GPS: SMD GPS Module; AVAILABILITY: Unavailable; DESCRIPTION: SMD GPS Module;; MF: u-blox; MP: NEO-6M-GPS; PACKAGE: None; PRICE: None
U4 = SIM800L:SIM800L: SIM8000L. Quad-band GSM/GPRS Module; AVAILABILITY: Unavailable; MF: Simcom; MP: SIM800L; PACKAGE: None; PRICE: None

## Net classes
0 default: width 0.254 mm

## Board
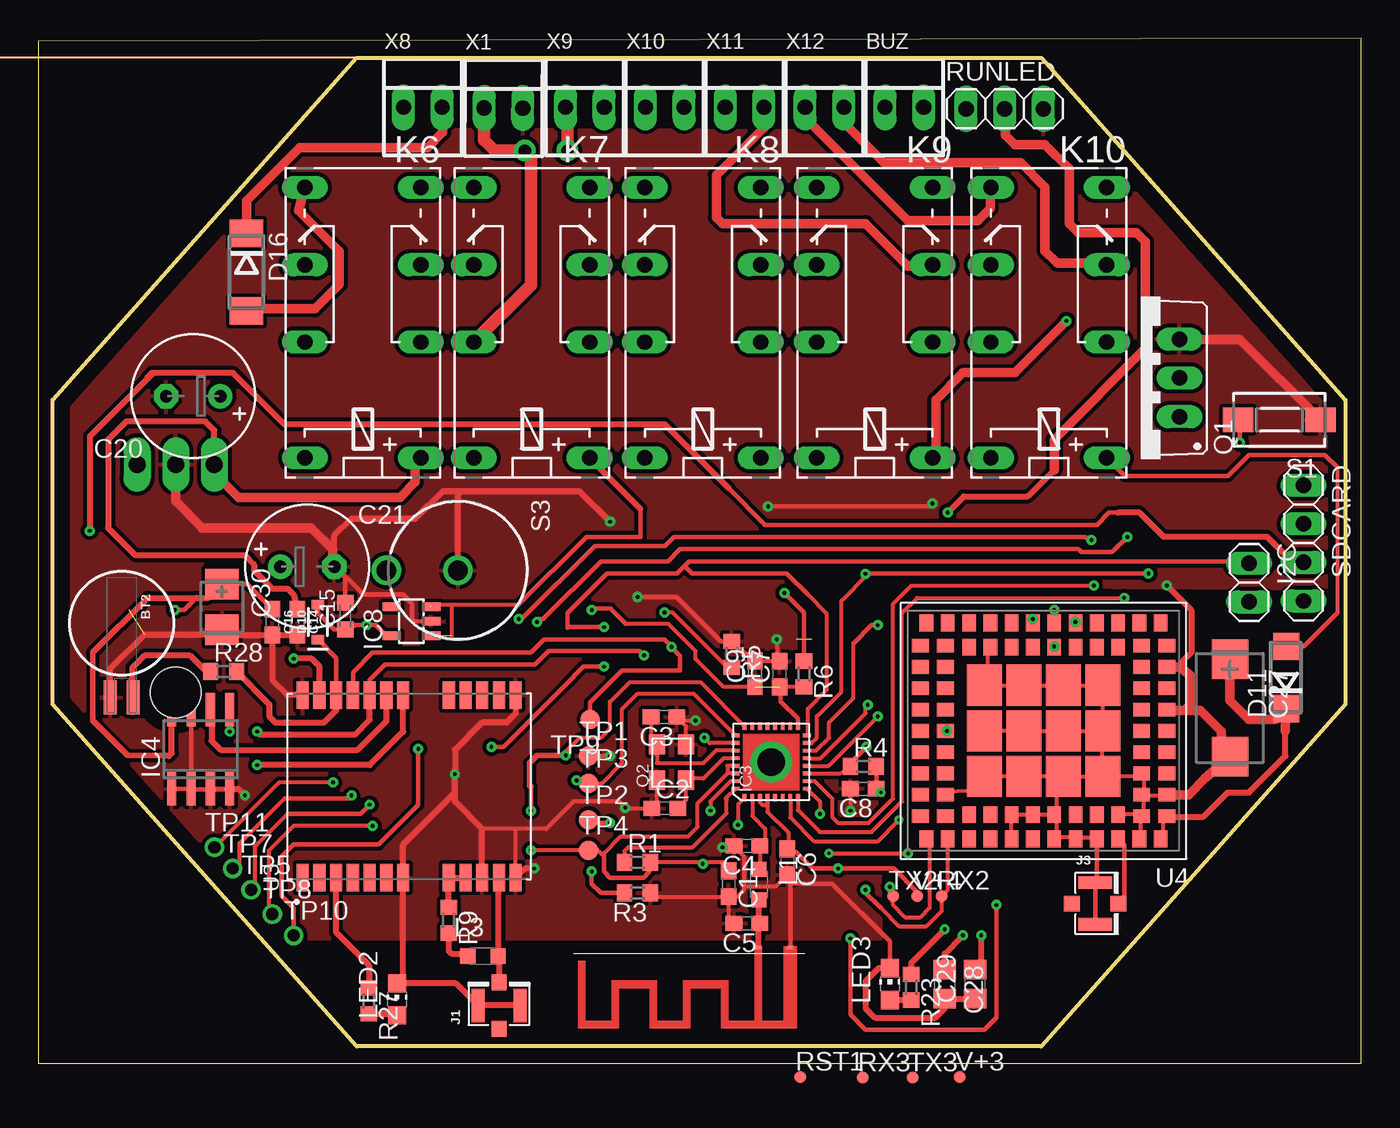
[diagram p6: board, top side]
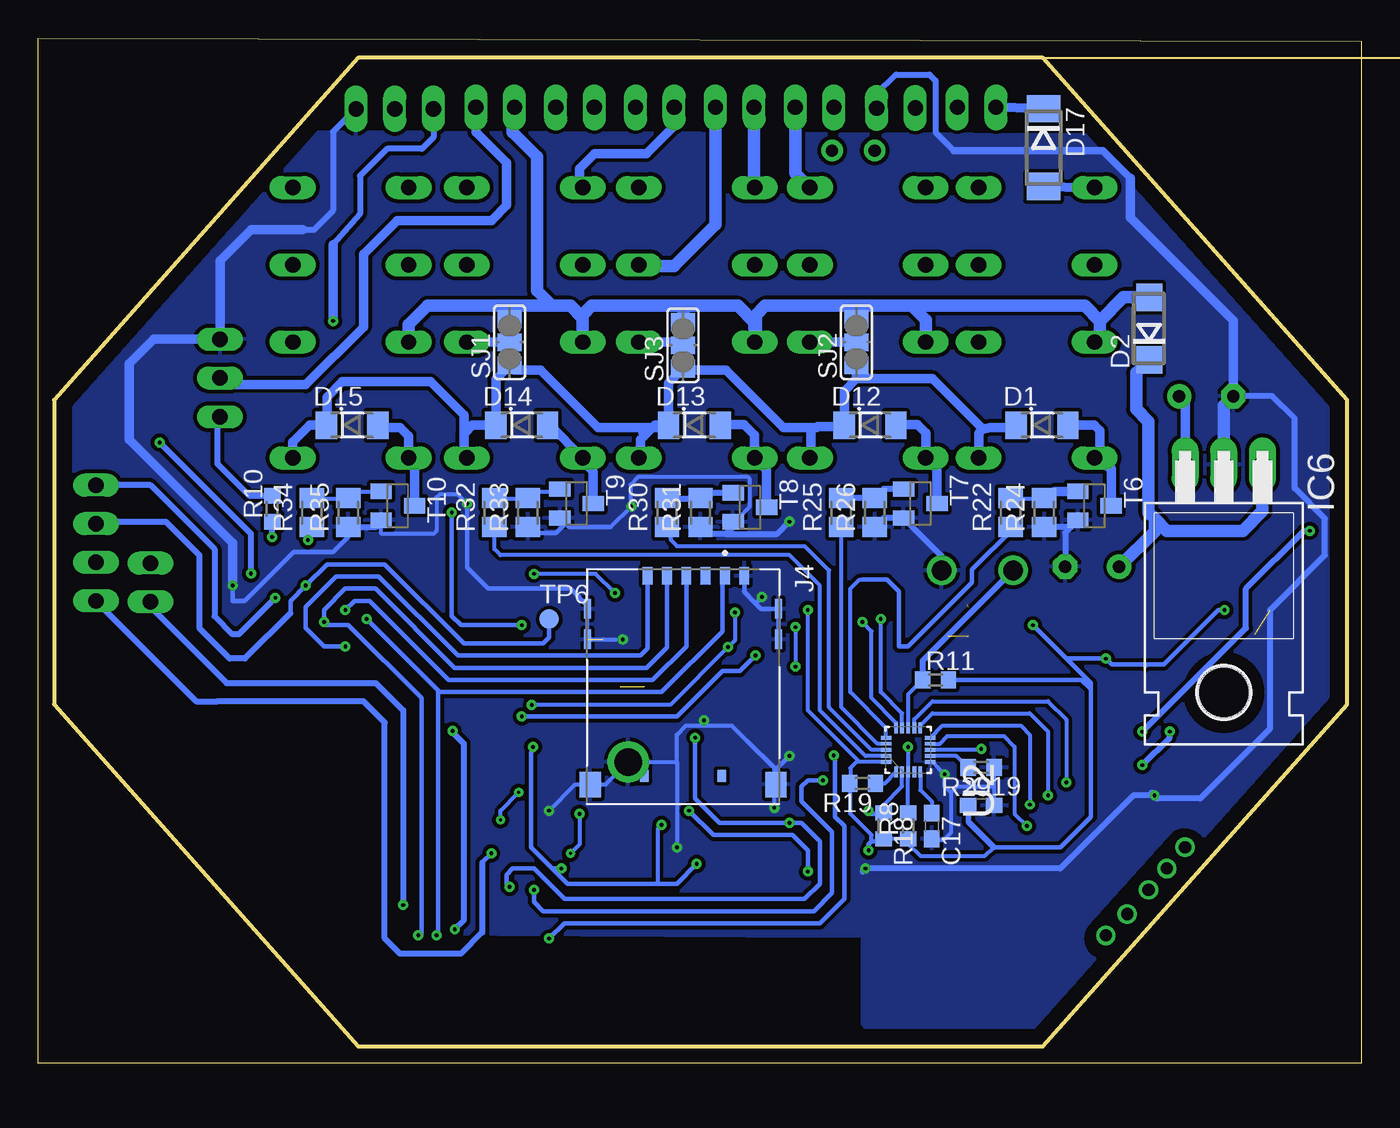
[diagram p7: board, bottom side, seen from below]

Size 87 x 67.4 mm. Coordinates in mm from the lower left corner, seen from the top.
Outline: 0,0 87,0 87,67.4 0,67.2 0,0
Outline: 0.95,43.6 20.95,66.1 65.95,66.1 85.95,43.6 85.95,23.6 65.95,1.1 20.95,1.1 0.95,23.6 0.95,43.6
Copper layers (1*16): Top 0.035mm / dielectric 1.5mm / Bottom 0.035mm
Design rules "default *": minimum track width 10mil, minimum drill 24mil, track to track 10mil, track to pad 10mil, pad to pad 10mil, via to via 10mil, smd to smd 20mil, copper to edge 40mil, drill to drill 8mil, minimum pad ring 10mil, minimum via ring 8mil, stop-mask expansion 4mil, vias tented up to drill 0mil, thermal gap 10mil
Milling: area -13.3,64.6 to -12.7,66.1; area -13.3,-9 to -12.7,-7.5; area -12.6,25.8 to -10.8,31.3; 3 lines

### Footprints (pad centres in the part's own frame; a part is rotated, then mirrored left to right if it is on the bottom)
2.4GHZ_PCB = smd 0.406 x 0.203: ANT 3.05,-0.4; GND 0.95,-0.4
BATTCON-6.8MM = smd 2.25 x 0.85: + 4.87,0.75; - 4.87,-0.75
22-23-2021 = drill 1 long: 1 -1.27,0; 2 1.27,0
C0603 = smd 1.1 x 1: 1 -0.85,0; 2 0.85,0
0603 = smd 1.1 x 1: 1 -0.85,0; 2 0.85,0
C0603K = smd 1.05 x 1.08: 1 -0.875,0; 2 0.875,0
E3,5-8 = drill 0.813 pad 1.6: + -1.778,0 | drill 0.813 pad 1.6 octagon: - 1.778,0
CT7343 = smd 2.6 x 2.4: + -3.2,0; - 3.2,0
C0805 = smd 1.3 x 1.5: 1 -0.95,0; 2 0.95,0
CT3528 = smd 2 x 2.2: + -1.5,0; - 1.5,0
SOD80_DO213AA_MINIMELF = smd 1.4 x 1.8: A 1.7,0; C -1.7,0
DO214AC = smd 1.8 x 1.7: A 2.05,0; C -2.05,0
SOD-323 = smd 0.63 x 0.83: A 1.15,0; C -1.15,0
DO214AA = smd 1.8 x 2.2: A 2.55,0; C -2.55,0
1X02 = drill 1.016 long: 1 -1.27,0; 2 1.27,0
ESP8266EX = smd 0.5 x 0.25: 1 -2.35,1.75; 2 -2.35,1.25; 3 -2.35,0.75; 4 -2.35,0.25; 5 -2.35,-0.25; 6 -2.35,-0.75; 7 -2.35,-1.25; 8 -2.35,-1.75; 17 2.35,-1.75; 18 2.35,-1.25; 19 2.35,-0.75; 20 2.35,-0.25; 21 2.35,0.25; 22 2.35,0.75; 23 2.35,1.25; 24 2.35,1.75 | smd 0.25 x 0.5: 9 -1.75,-2.35; 10 -1.25,-2.35; 11 -0.75,-2.35; 12 -0.25,-2.35; 13 0.25,-2.35; 14 0.75,-2.35; 15 1.25,-2.35; 16 1.75,-2.35; 25 1.75,2.35; 26 1.25,2.35; 27 0.75,2.35; 28 0.25,2.35; 29 -0.25,2.35; 30 -0.75,2.35; 31 -1.25,2.35; 32 -1.75,2.35 | drill 1.8 pad 2.286: ED 0,0
SO-08 = smd 0.6 x 2.2: 1 -1.905,-2.6; 2 -0.635,-2.6; 3 0.635,-2.6; 4 1.905,-2.6; 5 1.905,2.6; 6 0.635,2.6; 7 -0.635,2.6; 8 -1.905,2.6
TO220H = drill 1.118 pad 1.778 long: 1 -2.54,-10.16; 2 0,-10.16; 3 2.54,-10.16 | hole 3.302: 0,4.826
SOT23-DBV = smd 0.55 x 1.2: 1 -0.95,-1.3; 2 0,-1.3; 3 0.95,-1.3; 4 0.95,1.3; 5 -0.95,1.3
U.FL = smd 2.2 x 0.85: 1 0,1.375; 2 0,-1.375 | smd 1.05 x 1: FEED 1.525,0; NC -1.525,0
MOLEX_78646-3001 = smd 1.15 x 0.65: C1 -7.295,2.755; C2 -7.295,0.215; C3 -7.295,-2.325; C5 -7.295,4.025; C6 -7.295,1.485; C7 -7.295,-1.055 | smd 1.3 x 0.45: G1 -5.125,6.27; G2 -3.125,6.27; G3 -5.125,-6.27; G4 -3.125,-6.27 | smd 1.7 x 1.4: G5 6.435,-6.105; G6 6.435,6.105 | smd 0.8 x 0.54: X1 5.855,2.54; X2 5.855,-2.54
G6A-234P = drill 1.016 long: 1 -3.81,-3.81; 16 -3.81,3.81; O1 8.89,-3.81; O2 8.89,3.81; P1 3.81,-3.81; P2 3.81,3.81; S1 13.97,-3.81; S2 13.97,3.81
L2012C = smd 1 x 1: 1 -1,0; 2 1,0
CHIP-LED0805 = smd 1.2 x 1.2: A 0,-1.05; C 0,1.05
TO220BV = drill 1.016 long: D 0,-2.54; G -2.54,-2.54; S 2.54,-2.54
ABM8G = smd 1.3 x 1.05: 1 -1.15,-0.95; 2 1.2,-0.95; 3 1.2,0.95; 4 -1.15,0.95
R0603 = smd 1 x 1.1: 1 -0.85,0; 2 0.85,0
M0805 = smd 1.3 x 1.6: 1 -0.95,0; 2 0.95,0
TP08R = smd 0.8 x 0.8: TP 0,0
1X03 = drill 1.016 long: 1 -2.54,0; 2 0,0; 3 2.54,0
DTSM-3 = smd 2 x 1.6: 1 -2.7,0; 2 2.7,0
CM4400 = drill 1.3 pad 1.93: 1 0,0; 2 0,-4.7
1X04 = drill 1.016 long: 1 -3.81,0; 2 -1.27,0; 3 1.27,0; 4 3.81,0
SJ_2 = smd 1.168 x 1.6: 1 -1.524,0; 2 0,0; 3 1.524,0
SOT23-BEC = smd 1 x 1.4: B -0.95,-1.1; C 0,1.1; E 0.95,-1.1
B1,27 = smd 1.27 x 1.27: TP 0,0
QFN40P300X300X60-20N = smd 0.711 x 0.254: 1 -1.448,0.787; 2 -1.448,0.406; 3 -1.448,0; 4 -1.448,-0.406; 5 -1.448,-0.787; 11 1.448,-0.787; 12 1.448,-0.406; 13 1.448,0; 14 1.448,0.406; 15 1.448,0.787 | smd 0.254 x 0.711: 6 -0.787,-1.448; 7 -0.406,-1.448; 8 0,-1.448; 9 0.406,-1.448; 10 0.787,-1.448; 16 0.787,1.448; 17 0.406,1.448; 18 0,1.448; 19 -0.406,1.448; 20 -0.787,1.448
XCVR_NEO-6M-GPS = smd 1.8 x 0.8: 1 -6,7; 2 -6,5.9; 3 -6,4.8; 4 -6,3.7; 5 -6,2.6; 6 -6,1.5; 7 -6,0.4; 8 -6,-2.6; 9 -6,-3.7; 10 -6,-4.8; 11 -6,-5.9; 12 -6,-7; 13 6,-7; 14 6,-5.9; 15 6,-4.8; 16 6,-3.7; 17 6,-2.6; 18 6,0.4; 19 6,1.5; 20 6,2.6; 21 6,3.7; 22 6,4.8; 23 6,5.9; 24 6,7
MODULE_SIM800L = smd 1.1 x 0.9: 1 -8.1,5.6; 2 -8.1,4.2; 3 -8.1,2.8; 4 -8.1,1.4; 5 -8.1,0; 6 -8.1,-1.4; 7 -8.1,-2.8; 8 -8.1,-4.2; 9 -8.1,-5.6; 22 8.1,-5.6; 23 8.1,-4.2; 24 8.1,-2.8; 25 8.1,-1.4; 26 8.1,0; 27 8.1,1.4; 28 8.1,2.8; 29 8.1,4.2; 30 8.1,5.6; 43 -6.45,5.6; 44 -6.45,4.2; 45 -6.45,2.8; 46 -6.45,1.4; 47 -6.45,0; 48 -6.45,-1.4; 49 -6.45,-2.8; 50 -6.45,-4.2; 51 -6.45,-5.6; 60 6.45,-5.6; 61 6.45,-4.2; 62 6.45,-2.8; 63 6.45,-1.4; 64 6.45,0; 65 6.45,1.4; 66 6.45,2.8; 67 6.45,4.2; 68 6.45,5.6 | smd 0.9 x 1.1: 10 -7.7,-7.1; 11 -6.3,-7.1; 12 -4.9,-7.1; 13 -3.5,-7.1; 14 -2.1,-7.1; 15 -0.7,-7.1; 16 0.7,-7.1; 17 2.1,-7.1; 18 3.5,-7.1; 19 4.9,-7.1; 20 6.3,-7.1; 21 7.7,-7.1; 31 7.7,7.1; 32 6.3,7.1; 33 4.9,7.1; 34 3.5,7.1; 35 2.1,7.1; 36 0.7,7.1; 37 -0.7,7.1; 38 -2.1,7.1; 39 -3.5,7.1; 40 -4.9,7.1; 41 -6.3,7.1; 42 -7.7,7.1; 52 -4.9,-5.5; 53 -3.5,-5.5; 54 -2.1,-5.5; 55 -0.7,-5.5; 56 0.7,-5.5; 57 2.1,-5.5; 58 3.5,-5.5; 59 4.9,-5.5; 69 4.9,5.5; 70 3.5,5.5; 71 2.1,5.5; 72 0.7,5.5; 73 -0.7,5.5; 74 -2.1,5.5; 75 -3.5,5.5; 76 -4.9,5.5 | smd 2.3 x 2.7: 77 -3.9,3; 78 -3.9,0; 79 -3.9,-3; 80 -1.3,-3; 81 1.3,-3; 82 3.9,-3; 83 3.9,0; 84 3.9,3; 85 1.3,3; 86 -1.3,3; 87 -1.3,0; 88 1.3,0

### Placement (x,y rotation side)
ANT1  50.4,7.2 180 top
BT2  5.5,28.92 270 top
BUZ  56.95,62.85 0 top
C1  45.4,11.8 270 top
C2  41.2,16.76 0 top
C3  41.15,22.76 180 top
C4  46.6,14.29 180 top
C5  46.6,9.2 180 top
C6  49.25,13.24 270 top
C7  48.75,25.58 90 top
C8  54.25,18.05 180 top
C9  47.13,25.6 90 top
C14  17.05,29 270 top
C15  20.2,29.4 90 top
C16  15.4,29 270 top
C17  28.25,15.6 270 bottom
C19  25,16.95 0 bottom
C20  10.2,43.85 180 top
C21  17.7,32.65 0 top
C27  78.35,23.35 270 top
C28  59.6,5.2 270 top
C29  61.6,5.2 90 top
C30  12.1,30 270 top
D1  21,41.95 0 bottom
D2  13.95,48.3 90 bottom
D10  18.4,29 90 top
D11  82.05,25.35 90 top
D12  32.3,41.95 0 bottom
D13  43.85,41.95 0 bottom
D14  55.2,41.95 0 bottom
D15  66.35,41.95 0 bottom
D16  13.7,52 270 top
D17  20.9,60.2 270 bottom
I2C  79.6,31.6 270 top
IC3  48.2,19.8 90 top
IC4  10.7,20.65 0 top
IC6  9.05,29.2 180 bottom
IC8  24.55,29.05 90 top
J1  30.3,3.8 90 top
J3  69.5,10.5 0 top
J4  44.6,24.75 270 bottom
K6  21.35,43.6 90 top
K7  32.45,43.6 90 top
K8  43.7,43.6 90 top
K9  55,43.6 90 top
K10  66.45,43.6 90 top
L1  47.4,11.75 270 top
L3  29.25,7.05 0 top
LED2  23.6,4.2 0 top
LED3  56,5.2 0 top
Q1  72.5,45.05 90 top
Q2  41.65,19.76 90 top
R1  39.4,13.2 0 top
R3  39.4,11.2 180 top
R4  54.25,19.51 0 top
R5  45.6,26.87 270 top
R6  50.35,25.58 270 top
R8  29.8,15.6 90 bottom
R9  27,9.4 270 top
R10  71.6,36.45 90 bottom
R11  28,25.2 0 bottom
R18  31.4,15.6 270 bottom
R19  32.8,18.4 180 bottom
R22  23.05,36.2 90 bottom
R23  57.4,5 270 top
R24  20.85,36.2 90 bottom
R25  34.2,36.2 90 bottom
R26  32,36.2 90 bottom
R27  21.75,4.1 270 top
R28  12.2,25.75 0 top
R29  25,19.45 180 bottom
R30  45.65,36.2 90 bottom
R31  43.45,36.2 90 bottom
R32  57,36.2 90 bottom
R33  54.8,36.2 90 bottom
R34  69,36.2 90 bottom
R35  66.6,36.2 90 bottom
RST1  50.1,-0.9 0 top
RUNLED  63.55,62.75 0 top
RX2  59.4,11 0 top
RX3  54.2,-0.95 0 top
S1  81.6,42.3 180 top
S3  27.6,32.4 270 top
SDCARD  83.2,34.2 270 top
SJ1  56,47.4 90 bottom
SJ2  33.2,47.4 90 bottom
SJ3  44.6,47.2 90 bottom
T6  17.55,36.65 270 bottom
T7  29,36.8 270 bottom
T8  40.2,36.55 270 bottom
T9  51.6,36.8 270 bottom
T10  63.35,36.65 270 bottom
TP1  36.2,20.2 0 top
TP2  36.2,16 0 top
TP3  36.2,18.4 0 top
TP4  36.2,14 0 top
TP5  14,11.4 0 top
TP6  53.4,29.2 0 bottom
TP7  12.8,12.8 0 top
TP8  15.4,9.8 0 top
TP9  36.3,22.6 180 top
TP10  16.8,8.4 0 top
TP11  11.6,14.2 0 top
TX2  56.2,11 0 top
TX3  57.5,-0.95 0 top
U2  29.8,20.6 90 bottom
U3  24.4,18.2 90 top
U4  66.1,21.85 180 top
V+3  60.6,-0.9 0 top
V+4  57.8,11 0 top
X1  30.6,62.8 359.7 top
X8  25.3,62.85 0 top
X9  35.95,62.85 0 top
X10  41.2,62.85 0 top
X11  46.45,62.85 0 top
X12  51.7,62.85 0 top

### Tracks (layer width: path | path; a pad name or v marks a point on that pad's centre or on a via)
+3V3  (via drill 0.25)  (1 unrouted)
  Top 0.254: IC3.30 45.31,19.05 | 45.31,19.05 43.35,17.09 43.35,15.54 42.72,14.91 38.31,14.91 37.2,13.8 | IC3.29 45.31,19.55 45.31,19.05 | 43.8,13.2 45.1,13.2 C1.1 | 43.8,13.2 R1.2 40.15,12.98 39.98,12.98 | IC3.3 47.45,17.15 47.6,17 47.8,17 47.95,16.85 | IC3.11 52.7,19.05 R4.1 53.43,19.19 | V+4.TP 57.8,11.25 | v43.7,13.1 43.8,13.2 | 37.2,13.6 36.6,14.2 TP4.TP v32.4,14 | IC3.4 47.95,16.85 | IC3.1 46.02,17.02 v46.02,15.67 | 47.95,16.85 47.95,16.53 49.32,15.16 49.32,14.16 C6.1 | R6.2 C7.1 | C9.1 45.07,24.75 43.23,26.59 43.23,27.1 41.45,28.88 38.65,28.88 | 36.49,29.89 v36.4,29.8
  Top 0.3: 56.25,12.8 v52.6,12.8 50.92,12.8 49.83,13.89 49.45,13.89 C6.1 | 53.43,19.19 53.43,19.78 v54.45,20.8 | IC3.17 49.95,22.66 48.81,23.8 48.81,24.54 C7.1 | 36.49,29.89 37.64,29.89 38.65,28.88
  Top 0.305: IC8.5 22.9,28.1 22.2,28.8 v21.6,28.8 20.88,28.8 C15.1 19.48,28.52 18.4,29.6 D10.A | C16.1 13.75,31.5 C30.+ 11.2,30.6 | v9,29.8 9.6,29.8 10.4,30.6 | 37.2,13.8 37.2,13.6 37.2,12.6 37.6,12.2 39.8,12.2 40.2,12.6 40.2,13.15 R1.2 | 57.8,11.25 56.25,12.8
  Top 0.354: 3.6,27 3.6,22.53 5.89,20.24 8.56,20.24 8.6,20.2
  Top 0.406: 3.6,27 7.2,30.6 10.4,30.6 11.2,30.6 | 8.6,20.2 8.8,20.4 IC4.8 | U3.23 18.5,26.1 18,26.6 v16.8,26.6
  Bottom 0.254: 21.39,28.61 v21.6,28.8 | 14.2,26.1 14.2,26.2 | R18.2 R8.1 29.8,14.43 29,13.64 24.74,13.64 24.18,14.2 | v36.4,29.8 36.4,23.2 33.01,19.81 U2.20 33.19,19.81 33.6,19.4 33.6,18.45 R19.2 33.6,18.35 33.6,16.4 32.2,15 32.2,14.6 | v46.02,15.67 46.27,15.41 46.27,11.8
  Bottom 0.305: v9,29.8 9.4,29.8 13,26.2 14.2,26.2 16.4,26.2 v16.8,26.6 19.4,26.6 | 19.4,26.6 v21.6,28.8 | 24.18,14.2 19.8,14.2 17.8,16.2 17.8,24.6 | R18.2 31.55,14.6 32.2,14.6 32.4,14.4 v32.4,14 | 33.8,18.25 R19.2 | v54.45,20.8 54.6,20.4 54.6,14.2 53.2,12.8 | 53.2,12.8 v52.6,12.8 | v43.7,13.1 45,11.8 46.27,11.8 52.2,11.8 53.2,12.8 | 17.8,24.6 17.8,25 19.4,26.6 | R11.2 18.4,25.2 17.8,24.6
  Bottom 0.354: 24.18,14.2 25.85,15.87 C19.1
+5V  (via drill 0.25)  (2 unrouted)
  Top 0.254: 85.4,39.2 85.4,29.6 | 31.57,30.12 27.2,30.12 | 27.2,30.12 25.91,30.12 | 27.2,30.12 27.2,28.1
  Top 0.305: D11.A 83.2,27.4 85.4,29.6 | 85.4,39.2 84.6,40 79.6,40 78.2,38.6 71.45,38.6 K10.1 | 31.57,30.12 36.05,34.6 39.6,34.6 39.6,36.45
  Top 0.406: IC6.3 11.59,41.61 11,42.2 5.8,42.2 4.6,41 4.6,35.2 6.4,33.4 13.6,33.4 14.2,32.8 14.2,32.4 15.4,31.2 16.4,31.2 16.8,30.8 C14.1 17.1,30.15 | K7.1 39.6,36.45
  Top 0.61: IC6.3 11.59,38.81 13.2,37.2 23.8,37.2 24.8,38.2 24.8,39.75 arc90 K6.1 | v67.6,48.8 64.2,45.4 60.8,45.4 59.01,43.61 59.01,39.99 arc-90 K9.1
  Bottom 0.254: 34.2,41.85 D12.C | 22.7,41.85 D1.C | 44.39,45.57 SJ3.1 | 47.4,41.43 47.19,41.21 | 55.7,45.57 SJ1.1 | K9.1 59.09,39.92 59,39.92
  Bottom 0.406: RUNLED.1 61.01,60.88 61.77,60.12 64.05,60.12 65.83,58.34 65.83,55.82 67.6,53.8
  Bottom 0.61: C20.+ 11.59,43.46 IC6.3 | 22.7,41.85 22.75,41.8 24.4,41.8 24.9,41.7 | 24.9,41.7 25.16,41.44 K6.1 | 24.9,41.7 28.2,45 33.2,45 | 33.2,45 34,44.2 D12.C | 34.2,41.85 35.75,41.85 35.8,41.8 36.2,41.8 | D13.C 46.45,41.95 47.19,41.21 47.4,41 47.4,39.9 K8.1 | 59,41.4 59,42.6 61.2,44.8 67,44.8 68,43.8 68,42 D15.C 69.15,41.95 70.26,40.84 K10.1 | 59,41.4 58.45,41.95 D14.C 56.9,44.98 SJ1.1 | v67.6,48.8 67.6,53.8 | 59,39.8 59,39.92 59,41.4 | SJ3.1 45.55,44.73 D13.C | SJ2.1 33.2,45 | K7.1 36.2,39.85 36.2,41.8 | 44.39,45.57 41.78,45.57 38,41.8 36.2,41.8 | 55.7,45.57 53.98,45.57 50.2,41.8 45.7,41.8 D13.C
+12V  (via drill 0.8 pad 1.42)
  Top 0.813: X1.1 29.33,60.67 30,60 v32,60 32.4,59.4 32.4,51.17 K7.P2
  Bottom 0.61: 45,49.8 44.4,49.2 SJ3.3 | SJ1.3 55.8,49.12 55.8,49.8 | SJ2.3 33.2,49.8
  Bottom 0.813: K7.P2 28.64,48.84 29.6,49.8 | 29.6,49.8 33.2,49.8 39.2,49.8 39.8,49.2 39.8,47.5 K8.P2 39.89,48.69 41,49.8 45,49.8 50.6,49.8 51.2,49.2 51.2,49 | 51.2,49 51.2,47.6 K9.P2 | K10.P2 62.64,48.56 61.4,49.8 55.8,49.8 53.2,49.8 | 51.2,49 52,49.8 53.2,49.8 | 53.2,49.8 54.2,50.8 54.2,59.6 55.8,61.2 55.8,62.73 BUZ.1 | D2.A 15.65,50.35 17.2,48.8 | 17.2,48.8 17.2,47.47 K6.P2 | 17.2,48.8 18.2,49.8 29.6,49.8
BUZZER  (via drill 0.25)
  Top 0.254: v32.8,29 32.8,29.2
  Top 0.3: 62.2,33.8 68.4,33.8 68.6,33.6
  Top 0.305: v71.6,34.6 70.6,33.6 68.6,33.6 | 62.2,33.8 42.2,33.8 41.4,33 37,33 33.2,29.2 32.8,29.2
  Bottom 0.254: U2.15 30.59,22.39 32.2,24 32.2,28.4 v32.8,29
  Bottom 0.406: v71.6,34.6 R10.1
GND  (via drill 0.25)  (2 unrouted)
  Top 0.254: 68.2,14.85 66.95,14.85 | 68.2,14.85 69.45,14.85 U4.39 | 68.2,14.85 U4.38 | U4.35 63.95,14.85 63.95,16.35 U4.71 U4.72 U4.73 66.95,16.35 | 66.95,16.35 66.95,14.85 | 66.95,14.85 U4.37 | U4.83 U4.88 U4.87 69.95,21.85 | 62.45,24.85 62.45,27.35 U4.58 | 62.45,24.85 U4.81 U4.80 69.95,24.85 | 62.45,24.85 U4.82 | 69.95,24.85 69.95,21.85 | 69.95,24.85 U4.79 | 74.2,23.35 U4.6 | 72.7,17.6 74.2,17.6 U4.2 | U4.41 72.45,14.85 72.45,16.1 U4.43 | U4.76 72.45,16.35 U4.43 | 72.7,17.6 72.7,16.35 U4.43 | 72.7,17.6 U4.44 72.7,17.85 72.7,18.85 U4.45 72.45,18.85 U4.77 69.95,18.85 | U4.67 59.7,17.85 61.15,17.9 61.45,18.1 U4.84 U4.85 66.95,18.85 | U4.86 66.95,18.85 | U4.86 69.95,18.85 | 69.95,18.85 69.95,21.85 | 69.95,21.85 U4.78 | 66.95,18.85 66.95,16.35 | 67.2,18.85 U4.86 | 45.7,9.35 C5.2 45.4,9.55 C1.2 | C1.2 45.95,10.95 46.4,11.4 46.4,11.6 | 46.4,11.6 46.4,13.6 45.75,14.25 C4.2 45.35,14.29 v45,14.2 | 45.18,11.15 C1.2 | 42.56,20.6 Q2.2 42.6,22.15 C3.1 42.45,22.51 v43.23,22.53 | IC8.2 24.75,29.05 24.6,29.2 | C8.2 53.4,17.55 v53.4,16.6 | IC4.4 IC4.3 | 75.3,26.35 75.3,25.97 75.26,25.94 | v58.8,36.8 58.6,36.6 v48,36.6 | 31.4,15.4 33.4,15.4 35.2,17.2 38.2,17.2 v38.6,16.8 38.64,16.76 C2.1 40.7,17.12 Q2.4 | 31.4,15.4 29.2,15.4 | U3.12 31.4,15.4 | R5.1 C9.2 | C9.2 47.13,26.89 47.59,26.43 C7.2 48.56,26.5 v48.56,27.86 | R3.1 arc90 40.5,10.95 C1.2 | 50.25,11.8 49.51,11.8 49.45,11.86 49.45,12.19 C6.2 48.47,11.6 46.4,11.6 | 47.29,26.61 C9.2
  Top 0.3: 49.45,11.86 ANT1.GND | R5.1 44.89,27.72 41.96,30.65 v39.42,30.65
  Top 0.305: U4.39 69.6,11.98 J3.1 J3.2 69.38,9 | 24.6,29.2 24.6,30.2 24,30.8 21.4,30.8 19.55,32.65 C21.- 20.2,31.93 C15.2 | IC4.3 12.55,18.05 12.6,18 10.12,18 IC4.2 | IC4.1 IC4.2 | IC4.2 IC4.7 | LED3.C 56,8 52.2,11.8 50.25,11.8 | TP1.TP v37.6,20.2
  Top 0.406: BT2.- 4.75,25.95 7,28.2 11.8,28.2 C30.- 12.45,28.15 C16.2 | C16.2 15.4,25.2 16.4,24.2 U3.24 | C16.2 C14.2 | C21.- 19.48,34.68 20.6,35.8 24.8,35.8 26.6,37.6 27.8,37.6 | v74.2,31.4 75.8,29.8 75.8,27 75.26,26.46 75.26,25.94 | C29.1 C28.2 59.6,3.6 59,3 55,3 54.4,3.6 54.4,5.4 55.25,6.25 LED3.C | IC4.4 13.15,18.05 v13.6,17.6 | J1.2 J1.1 27.48,5.25 LED2.C 24,5.65 U3.7 24,14.4 27.4,17.8 v27.4,19 | v37.6,35.6 35.6,37.6 27.8,37.6 | S3.1 27.6,37.4 27.8,37.6 | U3.10 29.2,15.4 27.4,17.2 v27.4,19 | U3.13 31.4,23 30.8,22.4 29.2,22.4 27.4,20.6 v27.4,19 | v32.6,12.8 32,12.8 U3.12
  Top 0.61: U4.2 75.65,17.65 76.75,18.75 C27.- 77.8,20.7 77.8,21.8 76.4,23.2 75.4,23.2 | U4.8 75.15,26.05 75.26,25.94 75.8,25.4 75.8,23.6 75.4,23.2 | 75.4,23.2 74.25,23.2 U4.6 | C21.- 19.35,32.78 19.35,33.8 17.95,35.2 10.8,35.2 9.05,36.95 IC6.2 | S1.1 79.01,47.59 Q1.S
  Bottom 0.254: v38.6,16.8 38.6,18.21 J4.G6 38.5,18.7 | v53.4,16.6 51.69,18.32 J4.G5 49.69,18.32 IC3.ED 45,19.8 | 45,19.8 v45,14.2 | 49.35,35.25 v48,36.6 48.05,36.65 48.05,38.02 47.54,38.53 40.33,38.53 40.2,38.4 40.2,36.6 40.95,35.85 T8.E | v58.8,36.8 59.4,37.4 60.6,37.4 60.8,37.2 60.8,35 61,34.8 64.4,34.8 64.45,34.85 T10.E | 50.87,30.07 J4.G3 J4.G4 48.58,27.88 v48.56,27.86 | 27,17.8 26.6,18.2 24.2,18.2 | 24.2,18.2 24.15,18.15 C19.2 | R29.1 24.15,18.25 24.2,18.2 | U2.6 28.21,19.81 v27.4,19 27.4,18.2 27,17.8 | 45,19.8 45,21.6 44.4,22.2 43.23,22.2 | 43.23,22.2 41.4,22.2 40.4,21.2 | 27,17.8 27,15.13 27.48,14.65 27.9,14.65 C17.2 | v43.23,22.53 43.23,22.2 | 49.84,27.88 49.83,27.86
  Bottom 0.3: v39.42,30.65 39.84,30.23
  Bottom 0.305: 75.25,47.8 Q1.S | R33.1 54.8,35.2 54.4,34.8 54.4,34.85 52.95,34.85 52.33,35.48 | 40.4,21.2 38.6,19.4 38.6,18.42 J4.G6 38.5,19.3 v37.6,20.2 | 38.35,28.36 J4.G2 J4.G1 39.48,29.88 39.84,30.23 40.6,31 40.58,31.02 J4.C5 40.6,32.02 | v74.2,31.4 74.2,30.4 73.4,30.4 70.2,33.6 67.6,33.6 66.6,34.6 R35.1 | 49.35,35.25 52.1,35.25 52.33,35.48 | 52.33,35.48 T9.E | 50.87,30.07 52,31.2 57.4,31.2 58.8,32.6 v58.8,36.8
  Bottom 0.406: R24.1 19.1,35.25 T6.E 19.48,34.87 C21.- | T8.E 41.3,35.3 41.8,34.8 | 41.8,34.8 42.75,34.8 R31.1 | 41.8,34.8 38.4,34.8 v37.6,35.6 | R35.1 64.9,35.25 arc-90 T10.E | v13.6,17.6 13.8,17.8 | R26.1 31.4,35.85 T7.E 27.6,33.35 S3.1 | v13.6,17.6 15,17.6 19.8,12.8 v32.6,12.8 32.8,12.6 | v13.6,17.6 13.4,17.4 10.6,17.4 6,22 6,29.8 2.4,33.4 2.4,35.8 4.4,37.8 4.4,42.4 5.85,43.85 C20.- | X1.2 31.87,63.73 30.6,65 28.4,65 28,64.6 28,61.2 26.8,60 | 66.2,62.64 67.61,61.23 67.61,56.05 68.88,54.78 69.58,54.78 69.6,54.8
  Bottom 0.5: 26.8,60 17,60 15.2,58.2
  Bottom 0.61: C20.- 8.42,48.82 15.2,55.6 15.2,58.2 | Q1.S 75.04,52.76 73,54.8 69.6,54.8 | 66.2,62.64 RUNLED.3 | 75.25,47.8 75.45,47.6 79.4,47.6 81,46 81,41 74.2,34.2 v74.2,31.4
  Bottom 0.813: C20.- 9.05,43.22 IC6.2
  pour Top: 15.2,8.2 55.4,8.2 55.2,31.4 86,31.2 85.8,43.4 70,61.2 17.2,61.4 11.4,55.2 0.8,43.4 1.2,23.8
  pour Bottom: 1,43.6 16.6,61 70.2,61.2 86,43.6 86.2,23.8 73.2,8.6 40.4,8.4 32.8,8.4 32.8,2.61 31.99,1.4 21,1.4 21,1.6 16.6,6.4 17.8,7 arc90 18,9.2 12.4,15.4 11.8,15.6 arc90 10,14 9.4,14.4 1,23.8
IO0  (via drill 0.25)
  Top 0.254: IC3.15 50.85,21.05 51.2,21.4 51.2,22.8 52.8,24.4 52.8,30.4 54.6,32.2 | v54.4,32.18 54.42,32.2 55.16,32.2
  Top 0.3: v49.07,30.91 50.35,29.63 R6.1
  Top 0.305: 54.6,32.2 55.16,32.2 v73,32.2 | v79,40.8 79,42.2 S1.2
  Bottom 0.254: v49.07,30.91 50.34,32.18 v54.4,32.18
  Bottom 0.406: v73,32.2 73,34.8 v79,40.8
IO2  (via drill 0.25)
  Top 0.254: IC3.14 51.15,20.55 52,21.4 52,22.4 53.6,24 53.6,27.6
  Top 0.305: 53.6,27.6 54.8,28.8 v55.2,28.8
  Top 0.406: v59.8,36.2 60.86,37.26 65.06,37.26 66.8,39
  Top 0.61: RUNLED.2 63.6,62.7 63.6,61 64.2,60.4 66.2,60.4 67.8,58.8 67.8,55.2 68.4,54.6 72.2,54.6 72.8,54 72.8,47 66.8,41 66.8,39
  Bottom 0.305: v55.2,28.8 59.2,28.8 59.8,29.4 v59.8,36.2
IO4  (via drill 0.25)
  Top 0.254: IC3.16 50.6,21.6 50.6,23.3 51.86,24.56 51.86,29.54 50.6,30.8
  Top 0.3: 34.8,28.6 34.87,28.67 v37.2,28.67 | 34.6,24.8 35.87,26.07 v37.2,26.07
  Top 0.305: I2C.1 79.47,33 42.8,33 42.5,32.7 | 42.5,32.7 42,32.2 37.4,32.2 34.8,29.6 34.8,28.6 | 50.6,30.8 49.2,32.2 43,32.2 42.5,32.7 | v29.8,20.8 30.6,20.8 34.6,24.8
  Bottom 0.254: v29.8,20.8 U2.3 R8.2 | v37.2,28.67 v37.2,26.07
IO5  (via drill 0.25)
  Top 0.254: v34.69,20.24 34.69,20.49 35.6,21.4 37,21.4 37.6,22 37.6,23.76 38.91,25.07 43.53,25.07 IC3.24
  Top 0.305: v63,10.4 63,3 62.2,2.2 54.4,2.2 53.4,3.2 v53.4,8.2 | v32.4,16.6 32.4,18.2
  Top 0.354: v34.69,20.24 32.81,20.24 32.3,19.73 32.3,18.3 arc90 32.4,18.2
  Bottom 0.254: U2.2 30.2,18.2 31.4,17 R18.1 31.45,16.4
  Bottom 0.305: v53.4,8.2 52.4,9.2 35.6,9.2 34,10.8 34,15.6 34.6,16.2 34.6,20.15 v34.69,20.24 | 31.45,16.4 32.2,16.4 v32.4,16.6
  Bottom 0.406: I2C.2 79.6,30 74.6,25 64.8,25 63,23.2 v63,10.4
IO12  (via drill 0.25)
  Top 0.254: IC3.10 51.05,18.55 52.2,17.4 52.2,16.2 52.6,15.8 54.6,15.8 56.2,17.4 56.2,30.2 57.4,31.4 v69.4,31.4
  Bottom 0.305: 70.4,29.6 70.4,30.4 v69.4,31.4 68,32.8 64.2,32.8 59,27.6 53.8,27.6 53.4,28 TP6.TP
  Bottom 0.406: SDCARD.2 83.07,35.6 78.6,35.6 76.4,33.4 76.4,28.6 74.4,26.6 73.4,26.6 70.4,29.6
IO13  (via drill 0.25)
  Top 0.254: 7.2,45.1 7.25,45.05 | 13.2,45.1 13.15,45.05 | IC3.12 51.95,19.55 v55.2,22.8
  Top 0.3: 31.8,26.2 32.68,26.2 33.57,27.1 39.56,27.1 v39.84,26.82 | 61,35.4 69.6,35.4 70.4,36.2
  Top 0.305: 71,36.2 70.4,36.2 | 45.4,37.8 47.8,35.4 61,35.4 | 31.8,26.2 22.8,26.2 21.8,25.2 U3.20
  Top 0.406: SDCARD.3 82.47,32.93 80.8,34.6 74,34.6 72.4,36.2 71,36.2 | 45.4,37.8 41.2,42 16.2,42 13.15,45.05 12.8,45.4 7.5,45.4 7.2,45.1 | 7.6,45.4 7.25,45.05 3.4,41.2 v3.4,35 | v14.4,21.8 14.6,21.6 20.8,21.6 21.8,22.6 U3.20
  Bottom 0.3: 42,25.8 40.85,25.8 v39.84,26.82
  Bottom 0.305: 42,25.8 45,22.8 v55.2,22.8
  Bottom 0.406: v3.4,35 3.8,35 7.6,31.2 7.6,28.6 v14.4,21.8
IO14  (via drill 0.2, 0.25)
  Top 0.254: v52,13.8 v57.2,13.8 | IC3.9 51.4,17.2 v51.4,16.4
  Bottom 0.254: v51.4,16.4 51.4,14.4 v52,13.8
  Bottom 0.305: v57.2,13.8 57.8,13.2
  Bottom 0.406: 57.8,13.2 57.8,8.6 59.2,7.2 63.2,7.2 64.2,8.2 64.2,22.4 65.6,23.8 74.8,23.8 75.2,23.8 76.61,23.8 SDCARD.4
IO15  (via drill 0.25)
  Top 0.254: IC3.13 51.45,20.05 54.4,23 54.4,23.6 54.35,23.55 v54.55,23.55 | 36.3,22.7 TP9.TP | R5.2 45.32,26.02 41.7,29.64 v41.19,29.64
  Top 0.3: 32.4,27 33.26,27.86 41.19,27.86 41.64,27.42 v41.64,27.36 42.21,26.79 42.21,25.83 38.4,25.83 36.3,23.73 36.3,22.7
  Top 0.305: U3.21 20.7,25.7 22,27 32.4,27
  Bottom 0.254: v54.55,23.55 54.6,23.6 45.4,23.6 v41.64,27.36 41.19,27.81 v41.19,29.64
IO16  (via drill 0.25)
  Top 0.254: IC3.8 49.95,16.65 51.4,15.2 54.8,15.2 56.8,17.2 56.8,29.6 57.8,30.6 v71.4,30.6
  Bottom 0.254: SDCARD.1 83.22,38.04 SDCARD.1
  Bottom 0.406: v71.4,30.6 73.8,28.2 74.2,28.2 75.4,29.4 75.4,33.8 79.61,38.01 81.81,38.01 82.6,38.01 SDCARD.1
N$1
  Top 0.254: R1.1 38.55,13.95 38.8,14.2 43.03,14.2 45.26,16.43 45.26,17.34 45.2,17.4 IC3.32
N$2  (via drill 0.25)
  Top 0.254: v44.2,16.6 44.2,17.2 45.55,18.55 IC3.31
  Top 0.305: v36.4,12.6 36.4,11.8 37,11.2 R3.2
  Bottom 0.305: v44.2,16.6 42.6,15 37.4,15 36.4,14 v36.4,12.6
N$3
  Top 0.254: IC3.28 45.07,20.05 43.73,18.72 42.71,18.72 Q2.1 42.6,17.32 C2.2
N$4
  Top 0.254: 47.45,13.1 L1.1 47.45,12.8 C4.1 47.8,14.64 47.8,15.41 46.95,16.26 IC3.2
N$5
  Top 0.254: IC3.27 44.55,20.55 43.73,19.73 40.69,19.73 40.69,20.24 | Q2.3 40.69,20.69 40.69,20.24 | C3.2 40.3,20.63 40.69,20.24
N$6
  Top 0.254: 47.45,10.85 L1.2
  Top 0.406: ANT1.ANT 47.35,9.1 arc-90 C5.1 47.4,9.25 L1.2
N$9  (via drill 0.25, 0.8 pad 1.27)
  Top 0.305: TP10.TP 16.8,10.2 16,11 16,13.6 16.8,14.4 22.4,14.4 25,17 v25,20.65
  Bottom 0.254: v25,20.65 25.2,20.6 U2.8
  other vias: 16.8,8.4
N$10  (via drill 0.2)
  Top 0.254: v56.6,16 55.2,14.6 51,14.6 49.45,16.15 IC3.7 | v55.4,17.8 C8.1
  Top 0.3: R4.2 C8.1
  Bottom 0.254: v56.6,16 56.6,16.6 v55.4,17.8
N$11
  Top 0.61: K6.S2 17.14,56.06 19.8,53.4 19.8,51.2 18.2,49.6 13.65,49.6 D16.A
  Bottom 0.61: D17.A 18.78,57.57 K6.S2
N$12  (via drill 0.25)
  Top 0.254: v59.75,21.85 U4.64
  Top 0.305: 59.8,21.8 59.7,21.8 v59.75,21.85
  Top 0.406: R23.1 57.4,6.6 v59.6,8.8
  Bottom 0.406: v59.6,8.8 59,9.4 59,21 59.85,21.85 v59.75,21.85
N$13
  Bottom 0.254: R19.1 31.34,18.4 U2.1
N$14
  Bottom 0.254: R29.2 26.64,20.19 U2.7
N$15  (via drill 0.25, 0.8 pad 1.27)
  Top 0.254: v22,15.6 16.8,15.6 15.2,14 15.2,10 TP8.TP
  Bottom 0.254: v22,15.6 22.8,16.4 22.8,20.8 23.51,21.51 27.22,21.51 27.73,21.01 U2.9
  other vias: 15.4,9.8
N$16
  Bottom 0.406: R10.2 73.1,37.3 75.2,39.4 75.2,42.35 Q1.G
N$17
  Top 0.254: U4.42 73.95,14.85 73.95,16.1 74.2,16.1 U4.1
  Top 0.406: 74.35,16.4 74.55,16.2 76.6,16.2 78.2,17.8 79.6,17.8 82,20.2 82,22.77 82.03,22.81
  Top 0.61: U4.1 74.35,16.4 | 82,21.85 82.03,22.81 D11.C 81.35,22.6 79.6,22.6 78.35,23.85 C27.+
N$18
  Bottom 0.254: U2.5 29,17.95 28.25,17.21 C17.1
N$19
  Bottom 0.61: K9.P1 59,47.4 SJ1.2
N$20
  Top 0.406: R27.1 21.75,6.45 19.6,8.6 U3.3
N$21
  Top 0.406: R27.2 23.5,3.25 LED2.A
N$22  (via drill 0.25, 0.8 pad 1.27)
  Top 0.254: v19.4,18.45 15.85,18.45 TP11.TP
  Top 0.305: 11.8,14.2 TP11.TP
  Bottom 0.254: U2.12 29.39,22.61 28.2,23.8 20.6,23.8 19.4,22.6 v19.4,18.45
  other vias: 11.6,14.2
N$23
  Bottom 0.61: X8.1 23.6,62.85 D17.C
N$24
  Bottom 0.813: IC6.1 6.51,36.29 7.8,35 12.8,35 13.6,35.8 | 13.6,35.8 14,36.2 14,42.2 14.8,43 14.8,45.4 D2.C | C21.+ 13.6,34.97 13.6,35.8
N$26
  Bottom 0.61: BUZ.2 58.22,61.22 56.2,59.2 56.2,56.4 57.2,55.4 63.4,55.4 65.6,53.2 65.6,48.4 69.4,44.6 74.59,44.6 Q1.D
N$27
  Bottom 0.61: K8.P1 44.41,47.41 SJ3.2
N$28
  Bottom 0.61: K7.P1 SJ2.2
N$29
  Top 0.305: D10.C 19.6,26.65 U3.22
  Top 0.406: R28.2 15.2,23.6 15.2,22.8 15.6,22.4 18.8,22.4 19.6,23.2 U3.22
N$30  (via drill 0.25, 0.8 pad 1.27)
  Top 0.254: TP5.TP 14.27,11.67 14.27,14.27 16.4,16.4
  Top 0.305: v21.8,17 21.2,16.4 16.4,16.4
  Bottom 0.254: U2.10 27.54,22.2 22.4,22.2 21.8,21.6 v21.8,17
  other vias: 14,11.4
N$31  (via drill 0.25, 0.8 pad 1.27)
  Top 0.254: TP7.TP 13.25,13.25 13.25,14.45 16.2,17.4
  Top 0.305: v20.6,17.6 arc-90 20.4,17.4 16.2,17.4
  Bottom 0.254: U2.11 29.01,22.19 28.2,23 21.8,23 20.6,21.8 v20.6,17.6
  other vias: 12.8,12.8
N$32
  Bottom 0.813: K7.S1 37.22,58.53 X9.2
N$35  (via drill 0.8 pad 1.42)
  Top 0.813: 34.8,62.04 v34.8,60
N$46
  Top 0.406: R23.2 LED3.A
N$47
  Top 0.305: U4.40 71.4,14.35 71.4,11 71.03,10.62 J3.FEED
N$48
  Top 0.406: R9.1 U3.8 U3.9
N$49
  Top 0.61: D16.C 13.7,56.7 17.2,60.2 25.6,60.2 26.6,61.2 26.6,62.82 X8.2
N$50
  Top 0.406: R9.2 27,7.4 27.2,7.2 28.15,7.2 L3.1
N$51
  Bottom 0.61: T6.C 16.45,39.1 K6.16 17.2,39.85 17.2,41.6 17.55,41.95 D1.A
N$52
  Top 0.406: R28.1 11.05,25.75 10,26.8 7,26.8 6.2,26 6.2,23.08 BT2.+
N$53
  Bottom 0.254: R22.2 22.7,37.1 20.7,37.1 R24.2
  Bottom 0.61: T6.B 20.15,37.6 R24.2
N$54
  Bottom 0.61: T7.C 27.9,39.05 K7.16 28.64,41.44 29.2,42 30.55,42 D12.A
N$55
  Bottom 0.406: T7.B 31.4,37.75 R26.2 R25.2
N$58
  Top 0.406: U3.11 30.25,12.15 L3.2 30.3,7.25 J1.FEED
N$60
  Bottom 0.61: T8.C 39.1,39 K8.16 39.89,41.29 40.6,42 42.1,42 D13.A
N$61
  Bottom 0.254: 43.2,37.6 R31.2 43.2,37.1 | 45.2,37.1 R30.2
  Bottom 0.406: 43.2,37.1 45.35,37.1 R30.2 | T8.B 42.6,37.5 R31.2
N$62
  Bottom 0.813: X10.2 42.47,55.13 45.2,52.4 47.42,52.4 K8.O1
N$63
  Bottom 0.813: X10.1 39.93,57.61 K8.S2
N$64
  Bottom 0.61: T9.C 50.5,38.9 51.19,39.59 K9.16 53.35,41.95 D14.A 53.45,42
N$65
  Bottom 0.254: T9.B 52.7,37.6 54.7,37.6 54.7,37.35 R33.2 54.95,37.1 56.95,37.1 R32.2
N$66
  Top 0.61: X11.2 47.72,61.52 44.6,58.4 44.6,55.6 45,55.2 54.4,55.2 57.2,52.4 58.92,52.4 K9.O1
N$67
  Bottom 0.61: X11.1 45.18,61.62 47,59.8 50.4,59.8 51.4,58.8 51.4,57.58 K9.S2
N$68
  Bottom 0.61: T10.C 62.25,39.4 K10.16 62.64,41.24 63.2,41.8 64.5,41.8 D15.A
N$69
  Bottom 0.254: T10.B 66.45,37.6 66.45,37.35 R35.2 66.7,37.1 68.7,37.1 R34.2
N$70
  Top 0.61: X12.2 52.97,61.83 55.6,59.2 64.6,59.2 66.2,57.6 66.2,53.4 67,52.6 70.15,52.6 K10.O1
N$71
  Top 0.61: X12.1 50.43,62.17 57.2,55.4 61.8,55.4 62.6,56.2 62.6,57.53 K10.S2
REL1
  Bottom 0.254: 22.85,35.2 R22.1 | U2.16 31.25,22.05 33.6,24.4 33.6,31.2 33,31.8 32.8,31.8
  Bottom 0.305: 22.85,35.2 25.6,32.45 25.6,31.6 29.8,27.4 30.4,27.4 30.4,31 31.2,31.8 32.8,31.8
  Bottom 0.406: R22.1 22.8,34.8
REL2
  Bottom 0.254: U2.17 31.81,21.01 34.2,23.4 R25.1
REL3
  Bottom 0.254: U2.18 32.2,20.6 35,23.4 35,32.4 36.6,34 45,34 45.4,34.4 R30.1
REL4
  Bottom 0.254: U2.19 32.6,20.2 35.6,23.2 35.6,31.4 37.6,33.4 56.6,33.4 57,33.8 R32.1
REL5  (via drill 0.25)
  Top 0.3: 61.4,34.6 68.8,34.6 v69.25,34.4
  Top 0.305: 61.4,34.6 41.8,34.6 41.2,34 36.6,34 31.8,29.2 v31.6,29.2
  Bottom 0.254: U2.14 30.2,23 31.6,24.4 v31.6,29.2
  Bottom 0.406: R34.1 v69.25,34.4
RXD  (via drill 0.25)
  Top 0.254: U4.32 59.8,11.4 RX2.TP 59.4,10 58.4,9 56.6,9 55.4,10.2 | TP3.TP 37.07,18.4 38.4,19.73 38.4,23.29 39.42,24.3 43.1,24.3 IC3.25
  Top 0.305: v54.4,11.4 54.4,11.2 55.4,10.2 | v35.4,18.6 35.8,18.6 TP3.TP
  Bottom 0.305: v54.4,11.4 54.4,10.6 53.8,10 36,10 34.8,11.2 34.8,15.2 36.8,17.2 36.8,18.2 36.4,18.6 v35.4,18.6
SCL2
  Top 0.406: IC4.6 11.4,23.19 11.4,21.2 12,20.6 21,20.6 22.9,22.5 U3.19
SDA2  (via drill 0.25)
  Top 0.406: v14.4,19.6 21.8,19.6 24,21.8 U3.18 | 12.61,22.01 v12.6,21.8 IC4.5
  Bottom 0.406: v14.4,19.6 12.6,21.4 v12.6,21.8
SIMCLK  (via drill 0.25)
  Top 0.305: v66.8,27.4 U4.55
  Bottom 0.305: v66.8,27.4 68.2,27.4 69.4,28.6 69.4,30 67.4,32 64.6,32 59.4,26.8 47.4,26.8 46.92,27.27 J4.C3
SIMDATA  (via drill 0.25)
  Top 0.305: v68.2,29 U4.14
  Top 0.406: C29.2 62,6.55 v62,8.4
  Bottom 0.305: v68.2,29 68.2,29.8 66.8,31.2 64.8,31.2 59.6,26 47,26 45.66,27.34 J4.C7 | v62,8.4 61.8,8.4 61.8,24 66.6,28.8 68.05,28.8 U4.14
  Bottom 0.406: U4.14 v68.2,29
SIMRST  (via drill 0.25)
  Top 0.305: v66.8,29.8 U4.15
  Bottom 0.305: v66.8,29.8 66.2,30.4 65.2,30.4 60,25.2 46.6,25.2 44.39,27.41 J4.C2
SIMVCC  (via drill 0.25)
  Top 0.254: U4.16 v65.4,29.2
  Top 0.406: C28.1 59.6,7.2 v60.8,8.4
  Bottom 0.305: J4.C1 42,31.89 42,28.4 46,24.4 60.6,24.4 60.7,24.5 | v65.4,29.2 60.7,24.5 | v60.8,8.4 60.7,8.5 60.7,24.5
TXD  (via drill 0.25)
  Top 0.254: U4.31 58.6,14.55 58.6,10.2 58,9.6 57,9.6 56.2,10.4 TX2.TP | IC3.26 44.15,21.05 v43.8,21.4
  Top 0.305: v56,11.6 56,11.2 TX2.TP | v37.6,15.8 36.4,15.8 TP2.TP
  Bottom 0.305: v43.8,21.4 43.8,17.4 42.2,15.8 v37.6,15.8 36.8,15.8 35.6,14.6 35.6,11.8 36.6,10.8 52.4,10.8 54.4,12.8 55.8,12.8 56.2,12.4 56.2,11.8 v56,11.6
VIBRATION
  Bottom 0.254: U2.13 29.8,24.25 R11.1
  Bottom 0.406: S3.2 28.85,26.45 R11.1